# EAGLE design kulgurpower (EAGLE 6.3)

## Sheet 1 of 5
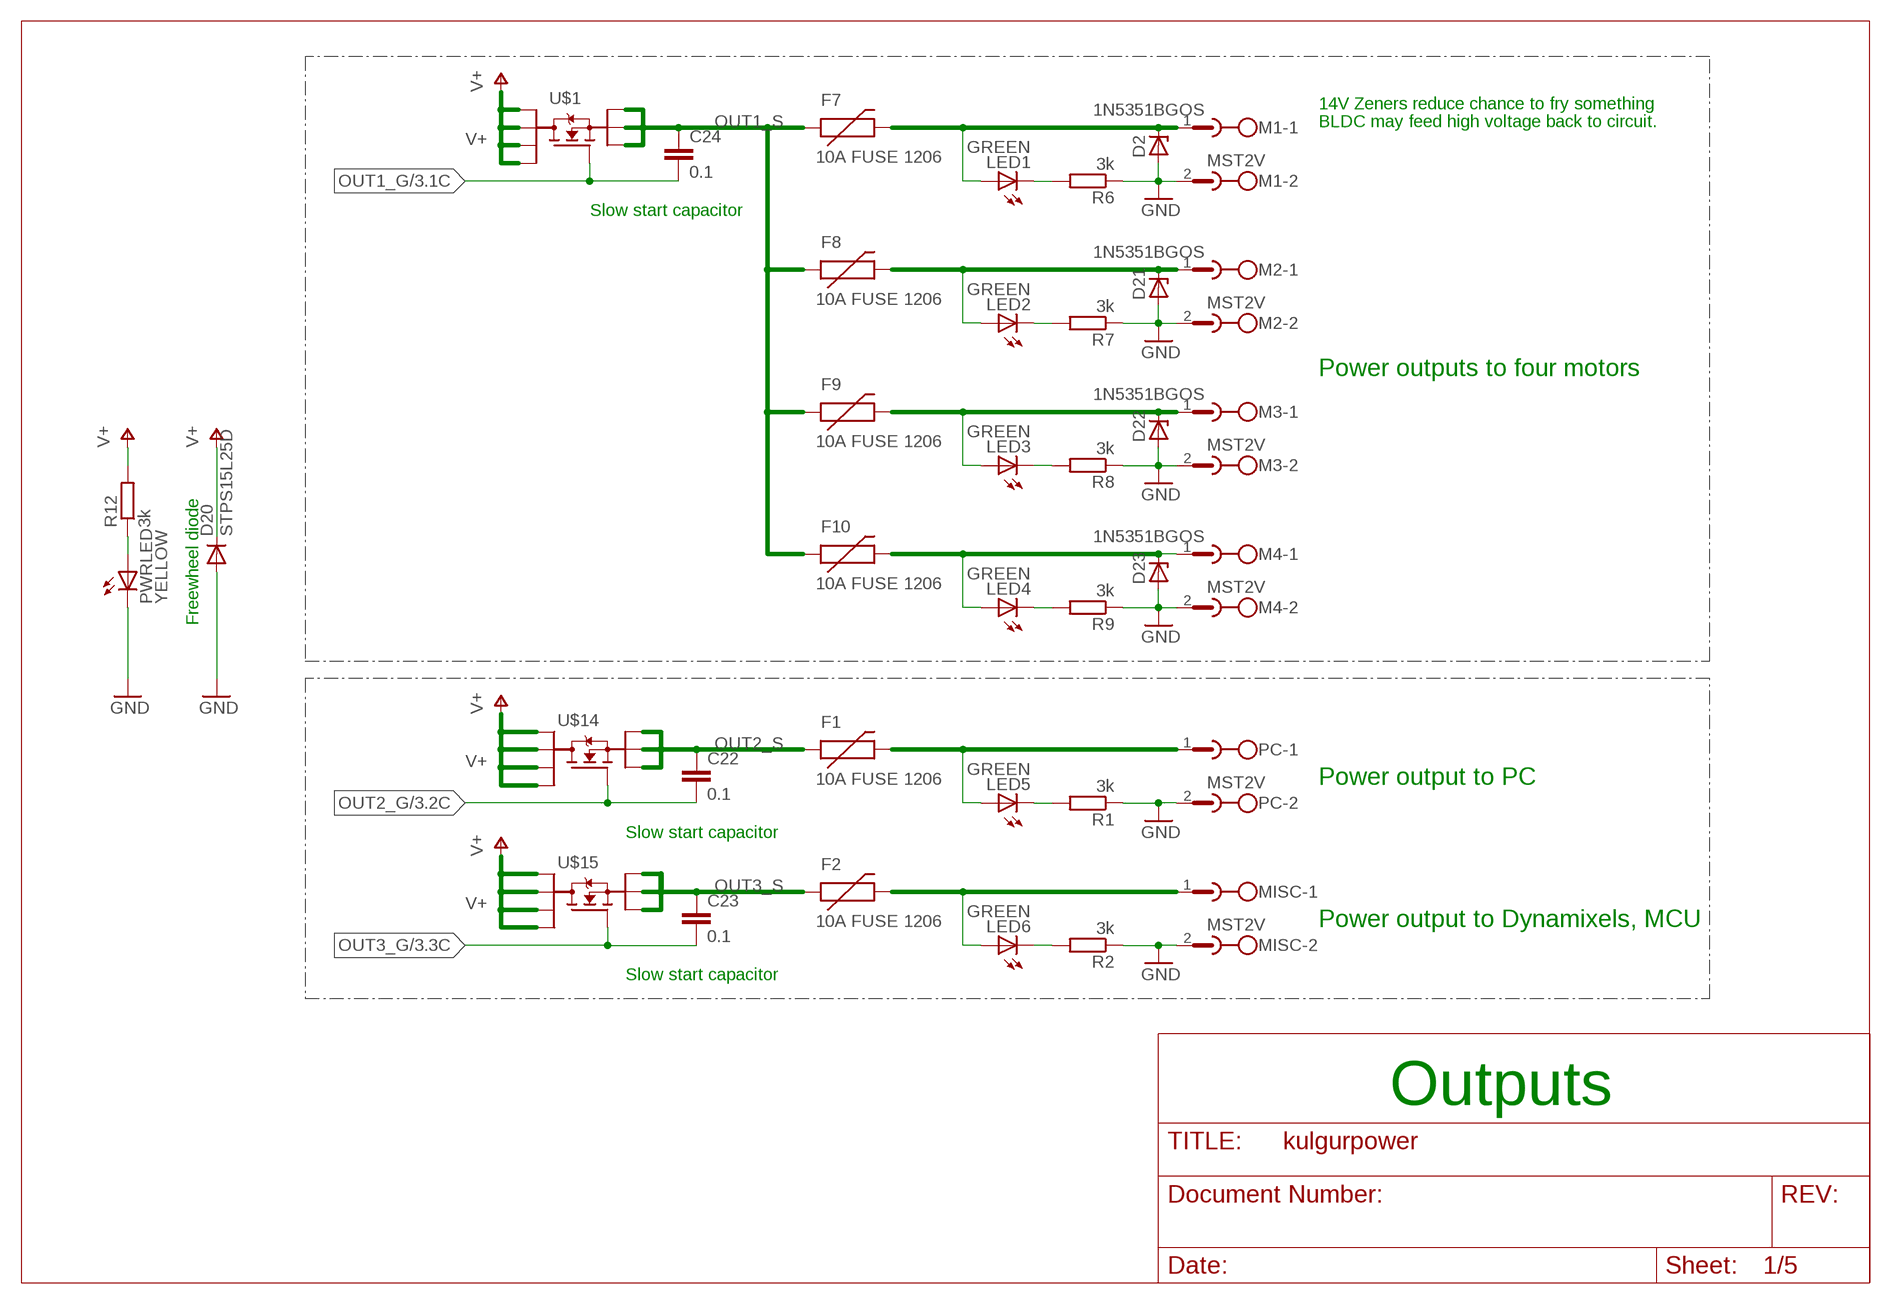
[diagram p0: schematic, sheet 1]

### Parts
C22  0.1  C-EUC0603  [C0603]
C23  0.1  C-EUC0603  [C0603]
C24  0.1  C-EUC0603  [C0603]
D2  1N5351BGOS  1N5333  [C1702-15]
D20  STPS15L25D  DIODE-C221B1A  [C221B1A]
D21  1N5351BGOS  1N5333  [C1702-15]
D22  1N5351BGOS  1N5333  [C1702-15]
D23  1N5351BGOS  1N5333  [C1702-15]
F1  10A FUSE 1206  PTCSMD  [PTC-1206]
F2  10A FUSE 1206  PTCSMD  [PTC-1206]
F7  10A FUSE 1206  PTCSMD  [PTC-1206]
F8  10A FUSE 1206  PTCSMD  [PTC-1206]
F9  10A FUSE 1206  PTCSMD  [PTC-1206]
F10  10A FUSE 1206  PTCSMD  [PTC-1206]
LED1  GREEN  LEDCHIP-LED0603  [CHIP-LED0603]
LED2  GREEN  LEDCHIP-LED0603  [CHIP-LED0603]
LED3  GREEN  LEDCHIP-LED0603  [CHIP-LED0603]
LED4  GREEN  LEDCHIP-LED0603  [CHIP-LED0603]
LED5  GREEN  LEDCHIP-LED0603  [CHIP-LED0603]
LED6  GREEN  LEDCHIP-LED0603  [CHIP-LED0603]
M1  MST2V  [MSTBV2]
M2  MST2V  [MSTBV2]
M3  MST2V  [MSTBV2]
M4  MST2V  [MSTBV2]
MISC  MST2V  [MSTBV2]
PC  MST2V  [MSTBV2]
PWRLED  YELLOW  LEDCHIP-LED0603  [CHIP-LED0603]
R1  3k  R-EU_R0603  [R0603]
R2  3k  R-EU_R0603  [R0603]
R6  3k  R-EU_R0603  [R0603]
R7  3k  R-EU_R0603  [R0603]
R8  3k  R-EU_R0603  [R0603]
R9  3k  R-EU_R0603  [R0603]
R12  3k  R-EU_R0603  [R0603]
U$1  AON6500  FDMS8558S  [POWER56]
U$14  AON6500  FDMS8558S  [POWER56]
U$15  AON6500  FDMS8558S  [POWER56]

### Nets
GND: D2.A D20.A D21.A D22.A D23.A M1.2 M2.2 M3.2 M4.2 MISC.2 PC.2 PWRLED.C R1.1 R2.1 R6.1 R7.1 R8.1 R9.1 ; also sheet 2,3,4,5
N$1 [morepower]: LED1.C R6.2
N$4 [morepower]: LED2.C R7.2
N$7 [morepower]: LED3.C R8.2
N$9 [morepower]: LED4.C R9.2
N$15 [morepower]: LED5.C R1.2
N$17 [morepower]: LED6.C R2.2
N$19 [morepower]: PWRLED.A R12.1
OUT1_G [power]: C24.2 U$1.P$4(G) ; also sheet 3
OUT1_S [morepower]: C24.1 F7.1 F8.1 F9.1 F10.1 U$1.P$1(S1) U$1.P$2(S2) U$1.P$3(S3) ; also sheet 3
OUT2_G [power]: C22.2 U$14.P$4(G) ; also sheet 3
OUT2_S [morepower]: C22.1 F1.1 U$14.P$1(S1) U$14.P$2(S2) U$14.P$3(S3) ; also sheet 3
OUT3_G [power]: C23.2 U$15.P$4(G) ; also sheet 3
OUT3_S [morepower]: C23.1 F2.1 U$15.P$1(S1) U$15.P$2(S2) U$15.P$3(S3) ; also sheet 3
PWR1 [morepower]: D2.C F7.2 LED1.A M1.1
PWR2 [morepower]: D21.C F8.2 LED2.A M2.1
PWR3 [morepower]: D22.C F9.2 LED3.A M3.1
PWR4 [morepower]: D23.C F10.2 LED4.A M4.1
PWR5 [morepower]: F1.2 LED5.A PC.1
PWR6 [morepower]: F2.2 LED6.A MISC.1
V+ [morepower]: D20.C R12.2 U$1.P$5(D4) U$1.P$6(D3) U$1.P$7(D2) U$1.P$8(D1) U$14.P$5(D4) U$14.P$6(D3) U$14.P$7(D2) U$14.P$8(D1) U$15.P$5(D4) U$15.P$6(D3) U$15.P$7(D2) U$15.P$8(D1) ; also sheet 2,3,4,5

### Notes on the sheet
- 14V Zeners reduce chance to fry something
- BLDC may feed high voltage back to circuit.
- Slow start capacitor
- Power outputs to four motors
- Freewheel diode
- Power output to PC
- Slow start capacitor
- Power output to Dynamixels, MCU
- Slow start capacitor
- Outputs

## Sheet 2 of 5
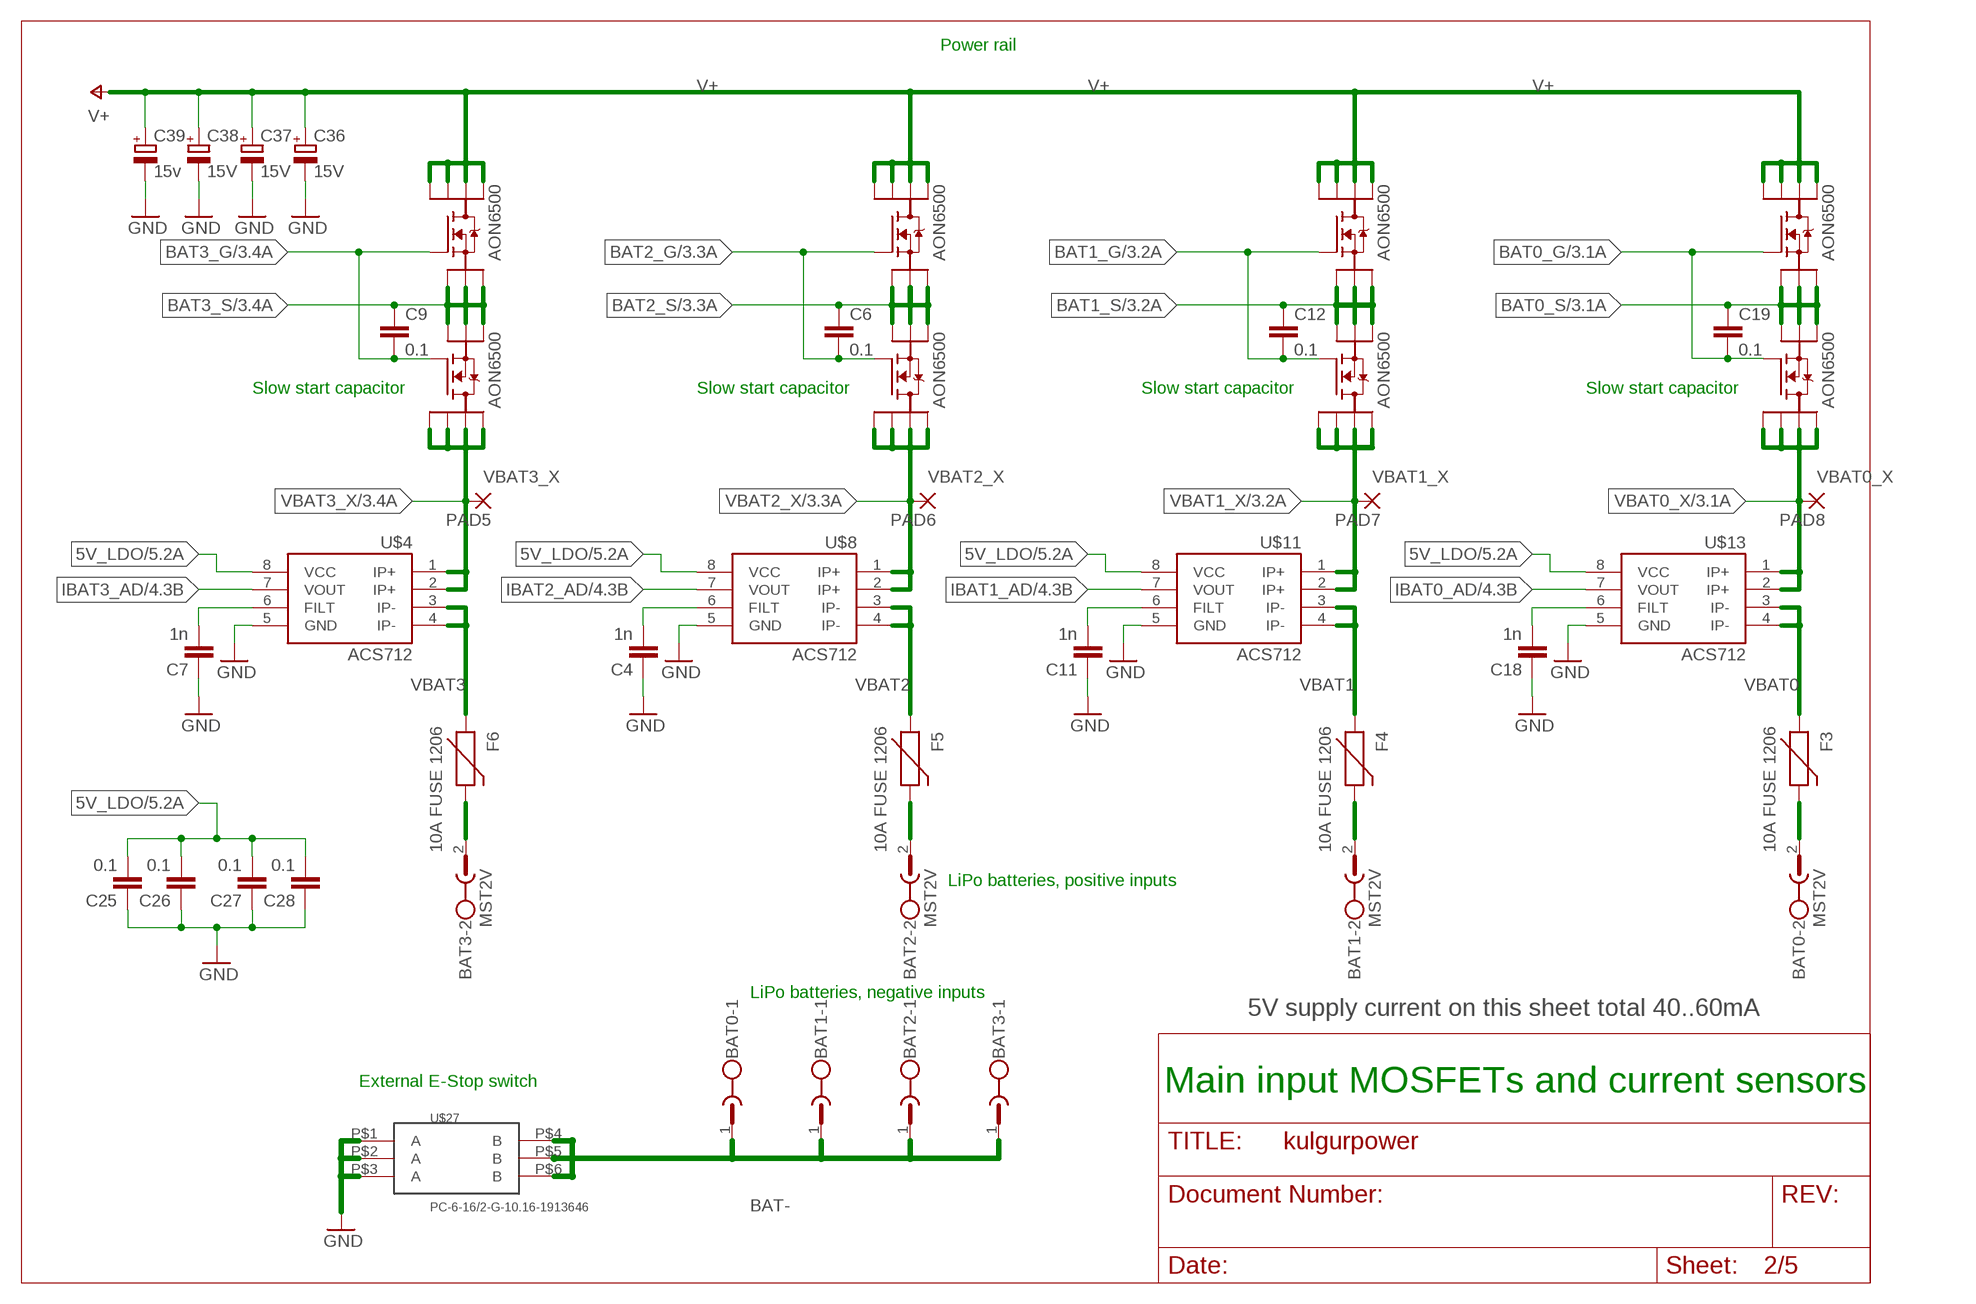
[diagram p1: schematic, sheet 2]

### Parts
BAT0  MST2V  [MSTBV2]
BAT1  MST2V  [MSTBV2]
BAT2  MST2V  [MSTBV2]
BAT3  MST2V  [MSTBV2]
C4  1n  C-EUC0603  [C0603]
C6  0.1  C-EUC0603  [C0603]
C7  1n  C-EUC0603  [C0603]
C9  0.1  C-EUC0603  [C0603]
C11  1n  C-EUC0603  [C0603]
C12  0.1  C-EUC0603  [C0603]
C18  1n  C-EUC0603  [C0603]
C19  0.1  C-EUC0603  [C0603]
C25  0.1  C-EUC0603  [C0603]
C26  0.1  C-EUC0603  [C0603]
C27  0.1  C-EUC0603  [C0603]
C28  0.1  C-EUC0603  [C0603]
C36  15V  CPOL-EUC/6032-28R  [C/6032-28R]
C37  15V  CPOL-EUC/6032-28R  [C/6032-28R]
C38  15V  CPOL-EU175TMP-0810  [175TMP-0810]
C39  15v  CPOL-EU175TMP-0810  [175TMP-0810]
F3  10A FUSE 1206  PTCSMD  [PTC-1206]
F4  10A FUSE 1206  PTCSMD  [PTC-1206]
F5  10A FUSE 1206  PTCSMD  [PTC-1206]
F6  10A FUSE 1206  PTCSMD  [PTC-1206]
PAD5  1,6/0,9  [1,6/0,9]
PAD6  1,6/0,9  [1,6/0,9]
PAD7  1,6/0,9  [1,6/0,9]
PAD8  1,6/0,9  [1,6/0,9]
U$2  AON6500  FDMS8558S  [POWER56]
U$3  AON6500  FDMS8558S  [POWER56]
U$4  ACS712  [SO08]
U$5  AON6500  FDMS8558S  [POWER56]
U$6  AON6500  FDMS8558S  [POWER56]
U$7  AON6500  FDMS8558S  [POWER56]
U$8  ACS712  [SO08]
U$9  AON6500  FDMS8558S  [POWER56]
U$10  AON6500  FDMS8558S  [POWER56]
U$11  ACS712  [SO08]
U$12  AON6500  FDMS8558S  [POWER56]
U$13  ACS712  [SO08]
U$27  PC-6-16/2-G-10.16-1913646  [PC-6-16/2-G-10.16]

### Nets
5V_LDO [power]: C25.2 C26.2 C27.2 C28.2 U$4.8(VCC) U$8.8(VCC) U$11.8(VCC) U$13.8(VCC) ; also sheet 5
BAT0_G [power]: C19.2 U$5.P$4(G) U$12.P$4(G) ; also sheet 3
BAT0_S [power]: C19.1 U$5.P$1(S1) U$5.P$2(S2) U$5.P$3(S3) U$12.P$1(S1) U$12.P$2(S2) U$12.P$3(S3) ; also sheet 3
BAT1_G [power]: C12.2 U$9.P$4(G) U$10.P$4(G) ; also sheet 3
BAT1_S [power]: C12.1 U$9.P$1(S1) U$9.P$2(S2) U$9.P$3(S3) U$10.P$1(S1) U$10.P$2(S2) U$10.P$3(S3) ; also sheet 3
BAT2_G [power]: C6.2 U$6.P$4(G) U$7.P$4(G) ; also sheet 3
BAT2_S [power]: C6.1 U$6.P$1(S1) U$6.P$2(S2) U$6.P$3(S3) U$7.P$1(S1) U$7.P$2(S2) U$7.P$3(S3) ; also sheet 3
BAT3_G [power]: C9.2 U$2.P$4(G) U$3.P$4(G) ; also sheet 3
BAT3_S [power]: C9.1 U$2.P$1(S1) U$2.P$2(S2) U$2.P$3(S3) U$3.P$1(S1) U$3.P$2(S2) U$3.P$3(S3) ; also sheet 3
BAT- [morepower]: BAT0.1 BAT1.1 BAT2.1 BAT3.1 U$27.P$4(B) U$27.P$5(B) U$27.P$6(B)
GND: C4.1 C7.1 C11.1 C18.1 C25.1 C26.1 C27.1 C28.1 C36.- C37.- C38.- C39.- U$4.5(GND) U$8.5(GND) U$11.5(GND) U$13.5(GND) U$27.P$1(A) U$27.P$2(A) U$27.P$3(A) ; also sheet 1,3,4,5
IBAT0_AD [power]: U$13.7(VOUT) ; also sheet 4
IBAT1_AD [power]: U$11.7(VOUT) ; also sheet 4
IBAT2_AD [power]: U$8.7(VOUT) ; also sheet 4
IBAT3_AD [power]: U$4.7(VOUT) ; also sheet 4
N$8 [morepower]: BAT0.2 F3.2
N$10 [morepower]: BAT1.2 F4.2
N$11 [power]: C4.2 U$8.6(FILT)
N$12 [morepower]: BAT2.2 F5.2
N$13 [morepower]: BAT3.2 F6.2
N$14 [power]: C11.2 U$11.6(FILT)
N$21 [power]: C7.2 U$4.6(FILT)
N$27 [power]: C18.2 U$13.6(FILT)
V+ [morepower]: C36.+ C37.+ C38.+ C39.+ U$2.P$5(D4) U$2.P$6(D3) U$2.P$7(D2) U$2.P$8(D1) U$5.P$5(D4) U$5.P$6(D3) U$5.P$7(D2) U$5.P$8(D1) U$6.P$5(D4) U$6.P$6(D3) U$6.P$7(D2) U$6.P$8(D1) U$9.P$5(D4) U$9.P$6(D3) U$9.P$7(D2) U$9.P$8(D1) ; also sheet 1,3,4,5
VBAT0 [morepower]: F3.1 U$13.3(IP-) U$13.4(IP-)
VBAT0_X [morepower]: PAD8.1(P) U$12.P$5(D4) U$12.P$6(D3) U$12.P$7(D2) U$12.P$8(D1) U$13.1(IP+) U$13.2(IP+) ; also sheet 3,4
VBAT1 [morepower]: F4.1 U$11.3(IP-) U$11.4(IP-)
VBAT1_X [morepower]: PAD7.1(P) U$10.P$5(D4) U$10.P$6(D3) U$10.P$7(D2) U$10.P$8(D1) U$11.1(IP+) U$11.2(IP+) ; also sheet 3,4
VBAT2 [morepower]: F5.1 U$8.3(IP-) U$8.4(IP-)
VBAT2_X [morepower]: PAD6.1(P) U$7.P$5(D4) U$7.P$6(D3) U$7.P$7(D2) U$7.P$8(D1) U$8.1(IP+) U$8.2(IP+) ; also sheet 3,4
VBAT3 [morepower]: F6.1 U$4.3(IP-) U$4.4(IP-)
VBAT3_X [morepower]: PAD5.1(P) U$3.P$5(D4) U$3.P$6(D3) U$3.P$7(D2) U$3.P$8(D1) U$4.1(IP+) U$4.2(IP+) ; also sheet 3,4

### Notes on the sheet
- Power rail
- Slow start capacitor | Slow start capacitor | Slow start capacitor | Slow start capacitor
- LiPo batteries, positive inputs
- LiPo batteries, negative inputs
- 5V supply current on this sheet total 40..60mA
- External E-Stop switch
- Main input MOSFETs and current sensors

## Sheet 3 of 5
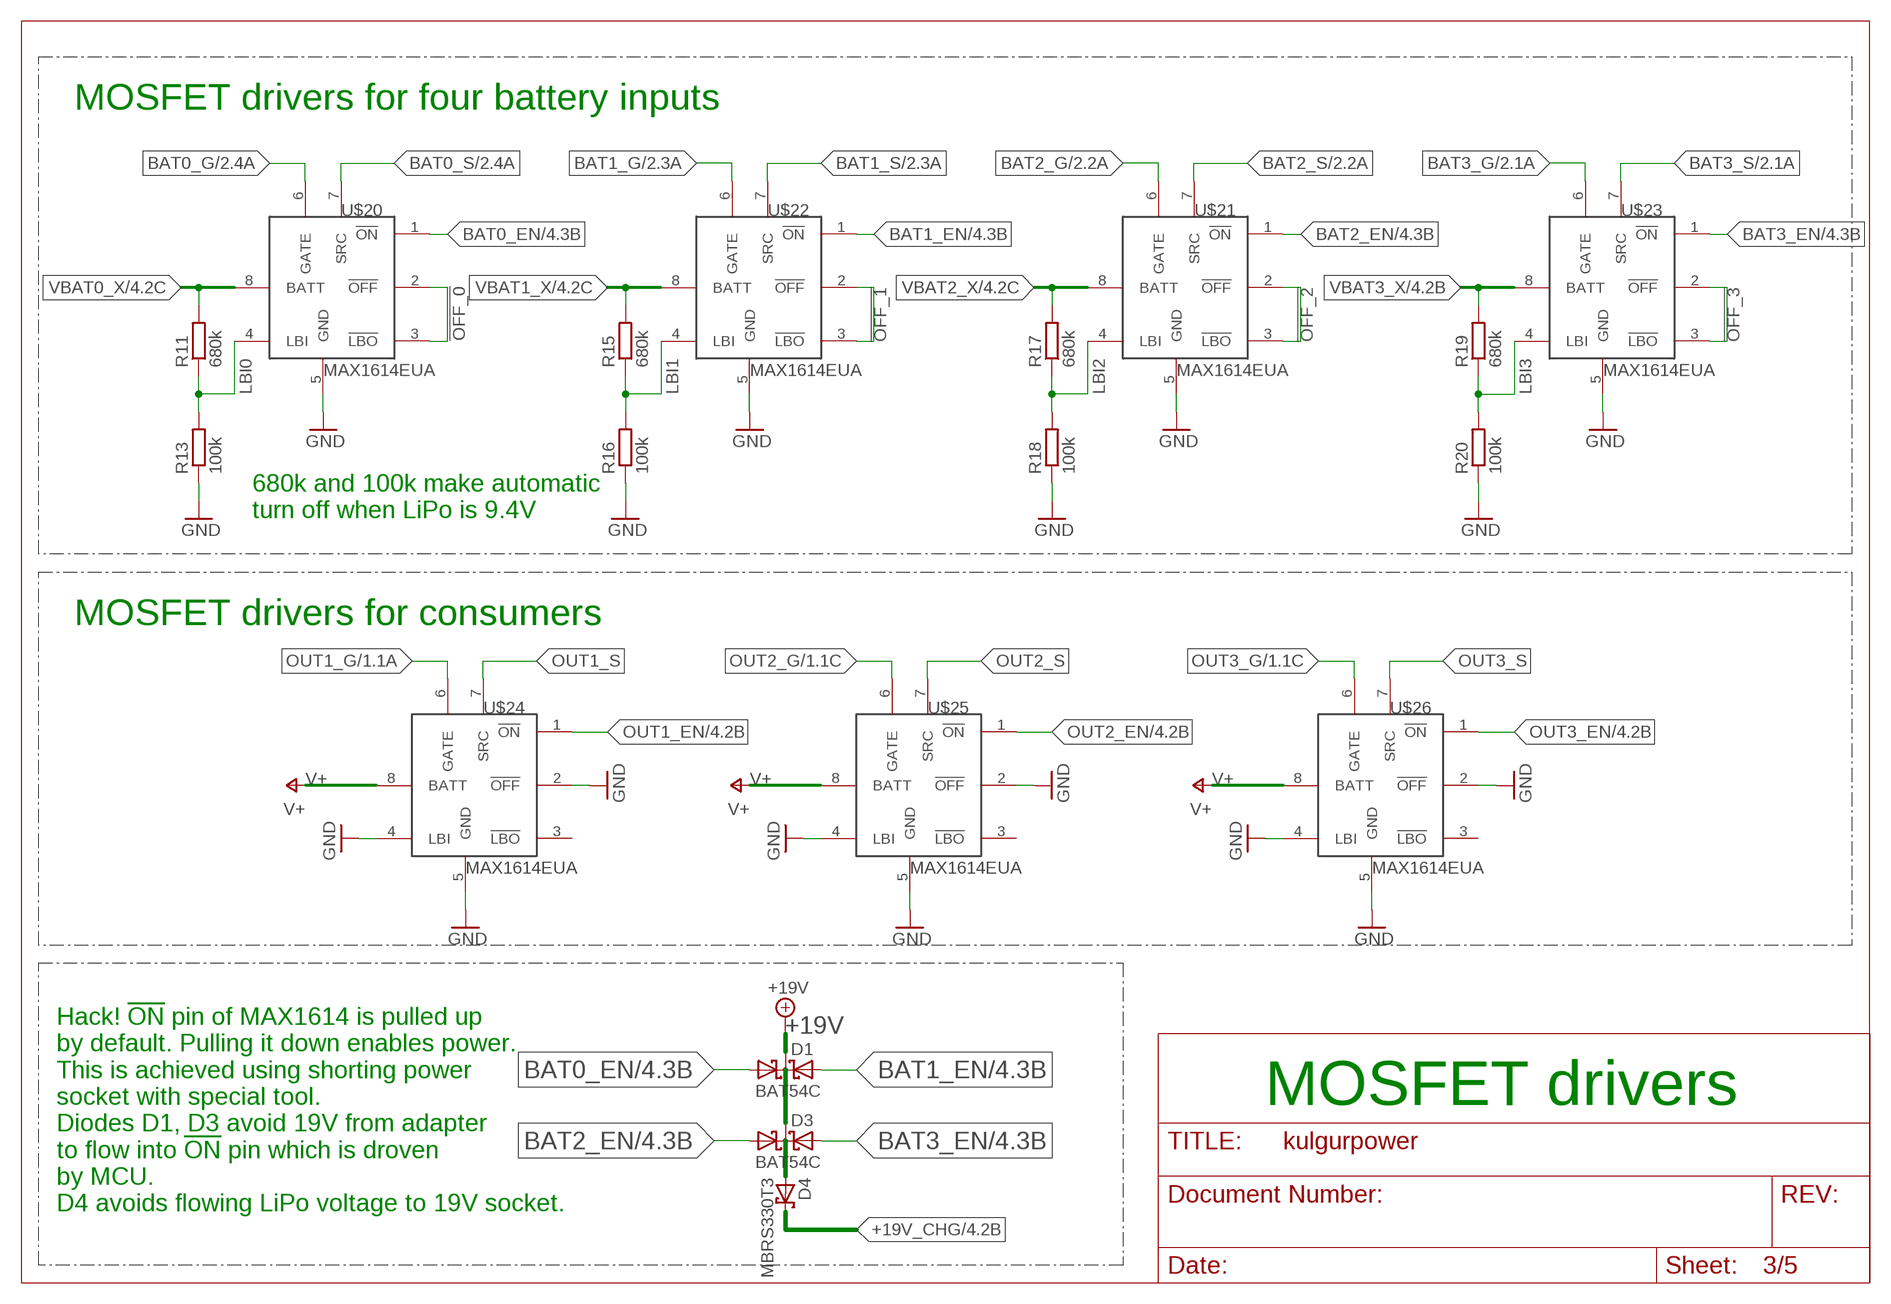
[diagram p2: schematic, sheet 3]

### Parts
D1  BAT54C  [SOT23]
D3  BAT54C  [SOT23]
D4  MBRS330T3  [SMC]
R11  680k  R-EU_R0603  [R0603]
R13  100k  R-EU_R0603  [R0603]
R15  680k  R-EU_R0603  [R0603]
R16  100k  R-EU_R0603  [R0603]
R17  680k  R-EU_R0603  [R0603]
R18  100k  R-EU_R0603  [R0603]
R19  680k  R-EU_R0603  [R0603]
R20  100k  R-EU_R0603  [R0603]
U$20  MAX1614EUA  [MAX1614EUA]
U$21  MAX1614EUA  [MAX1614EUA]
U$22  MAX1614EUA  [MAX1614EUA]
U$23  MAX1614EUA  [MAX1614EUA]
U$24  MAX1614EUA  [MAX1614EUA]
U$25  MAX1614EUA  [MAX1614EUA]
U$26  MAX1614EUA  [MAX1614EUA]

### Nets
!OFF_0 [morepower]: U$20.2(!OFF) U$20.3(!LBO)
!OFF_1 [morepower]: U$22.2(!OFF) U$22.3(!LBO)
!OFF_2 [morepower]: U$21.2(!OFF) U$21.3(!LBO)
!OFF_3 [morepower]: U$23.2(!OFF) U$23.3(!LBO)
+19V [morepower]: D1.3(CC) D3.3(CC) ; also sheet 4
+19V_CHG: D4.C ; also sheet 4
BAT0_EN [power]: D1.1(A1) U$20.1(!ON) ; also sheet 4
BAT0_G [power]: U$20.6(GATE) ; also sheet 2
BAT0_S [power]: U$20.7(SRC) ; also sheet 2
BAT1_EN [power]: D1.2(A2) U$22.1(!ON) ; also sheet 4
BAT1_G [power]: U$22.6(GATE) ; also sheet 2
BAT1_S [power]: U$22.7(SRC) ; also sheet 2
BAT2_EN [power]: D3.1(A1) U$21.1(!ON) ; also sheet 4
BAT2_G [power]: U$21.6(GATE) ; also sheet 2
BAT2_S [power]: U$21.7(SRC) ; also sheet 2
BAT3_EN [power]: D3.2(A2) U$23.1(!ON) ; also sheet 4
BAT3_G [power]: U$23.6(GATE) ; also sheet 2
BAT3_S [power]: U$23.7(SRC) ; also sheet 2
GND: R13.1 R16.1 R18.1 R20.1 U$20.5(GND) U$21.5(GND) U$22.5(GND) U$23.5(GND) U$24.2(!OFF) U$24.4(LBI) U$24.5(GND) U$25.2(!OFF) U$25.4(LBI) U$25.5(GND) U$26.2(!OFF) U$26.4(LBI) U$26.5(GND) ; also sheet 1,2,4,5
LBI0 [morepower]: R11.1 R13.2 U$20.4(LBI)
LBI1 [morepower]: R15.1 R16.2 U$22.4(LBI)
LBI2 [morepower]: R17.1 R18.2 U$21.4(LBI)
LBI3 [morepower]: R19.1 R20.2 U$23.4(LBI)
N$2: D4.A
OUT1_EN [power]: U$24.1(!ON) ; also sheet 4
OUT1_G [power]: U$24.6(GATE) ; also sheet 1
OUT1_S [morepower]: U$24.7(SRC) ; also sheet 1
OUT2_EN [power]: U$25.1(!ON) ; also sheet 4
OUT2_G [power]: U$25.6(GATE) ; also sheet 1
OUT2_S [morepower]: U$25.7(SRC) ; also sheet 1
OUT3_EN [power]: U$26.1(!ON) ; also sheet 4
OUT3_G [power]: U$26.6(GATE) ; also sheet 1
OUT3_S [morepower]: U$26.7(SRC) ; also sheet 1
V+ [morepower]: U$24.8(BATT) U$25.8(BATT) U$26.8(BATT) ; also sheet 1,2,4,5
VBAT0_X [morepower]: R11.2 U$20.8(BATT) ; also sheet 2,4
VBAT1_X [morepower]: R15.2 U$22.8(BATT) ; also sheet 2,4
VBAT2_X [morepower]: R17.2 U$21.8(BATT) ; also sheet 2,4
VBAT3_X [morepower]: R19.2 U$23.8(BATT) ; also sheet 2,4
Unconnected: U$24.3(!LBO) U$25.3(!LBO) U$26.3(!LBO)

### Notes on the sheet
- MOSFET drivers for four battery inputs
- 680k and 100k make automatic 
  turn off when LiPo is 9.4V
- MOSFET drivers for consumers
- MOSFET drivers
- Hack! !ON! pin of MAX1614 is pulled up 
  by default. Pulling it down enables power. 
  This is achieved using shorting power
  socket with special tool.
  Diodes D1, D3 avoid 19V from adapter 
  to flow into !ON! pin which is droven 
  by MCU.
  D4 avoids flowing LiPo voltage to 19V socket.

## Sheet 4 of 5
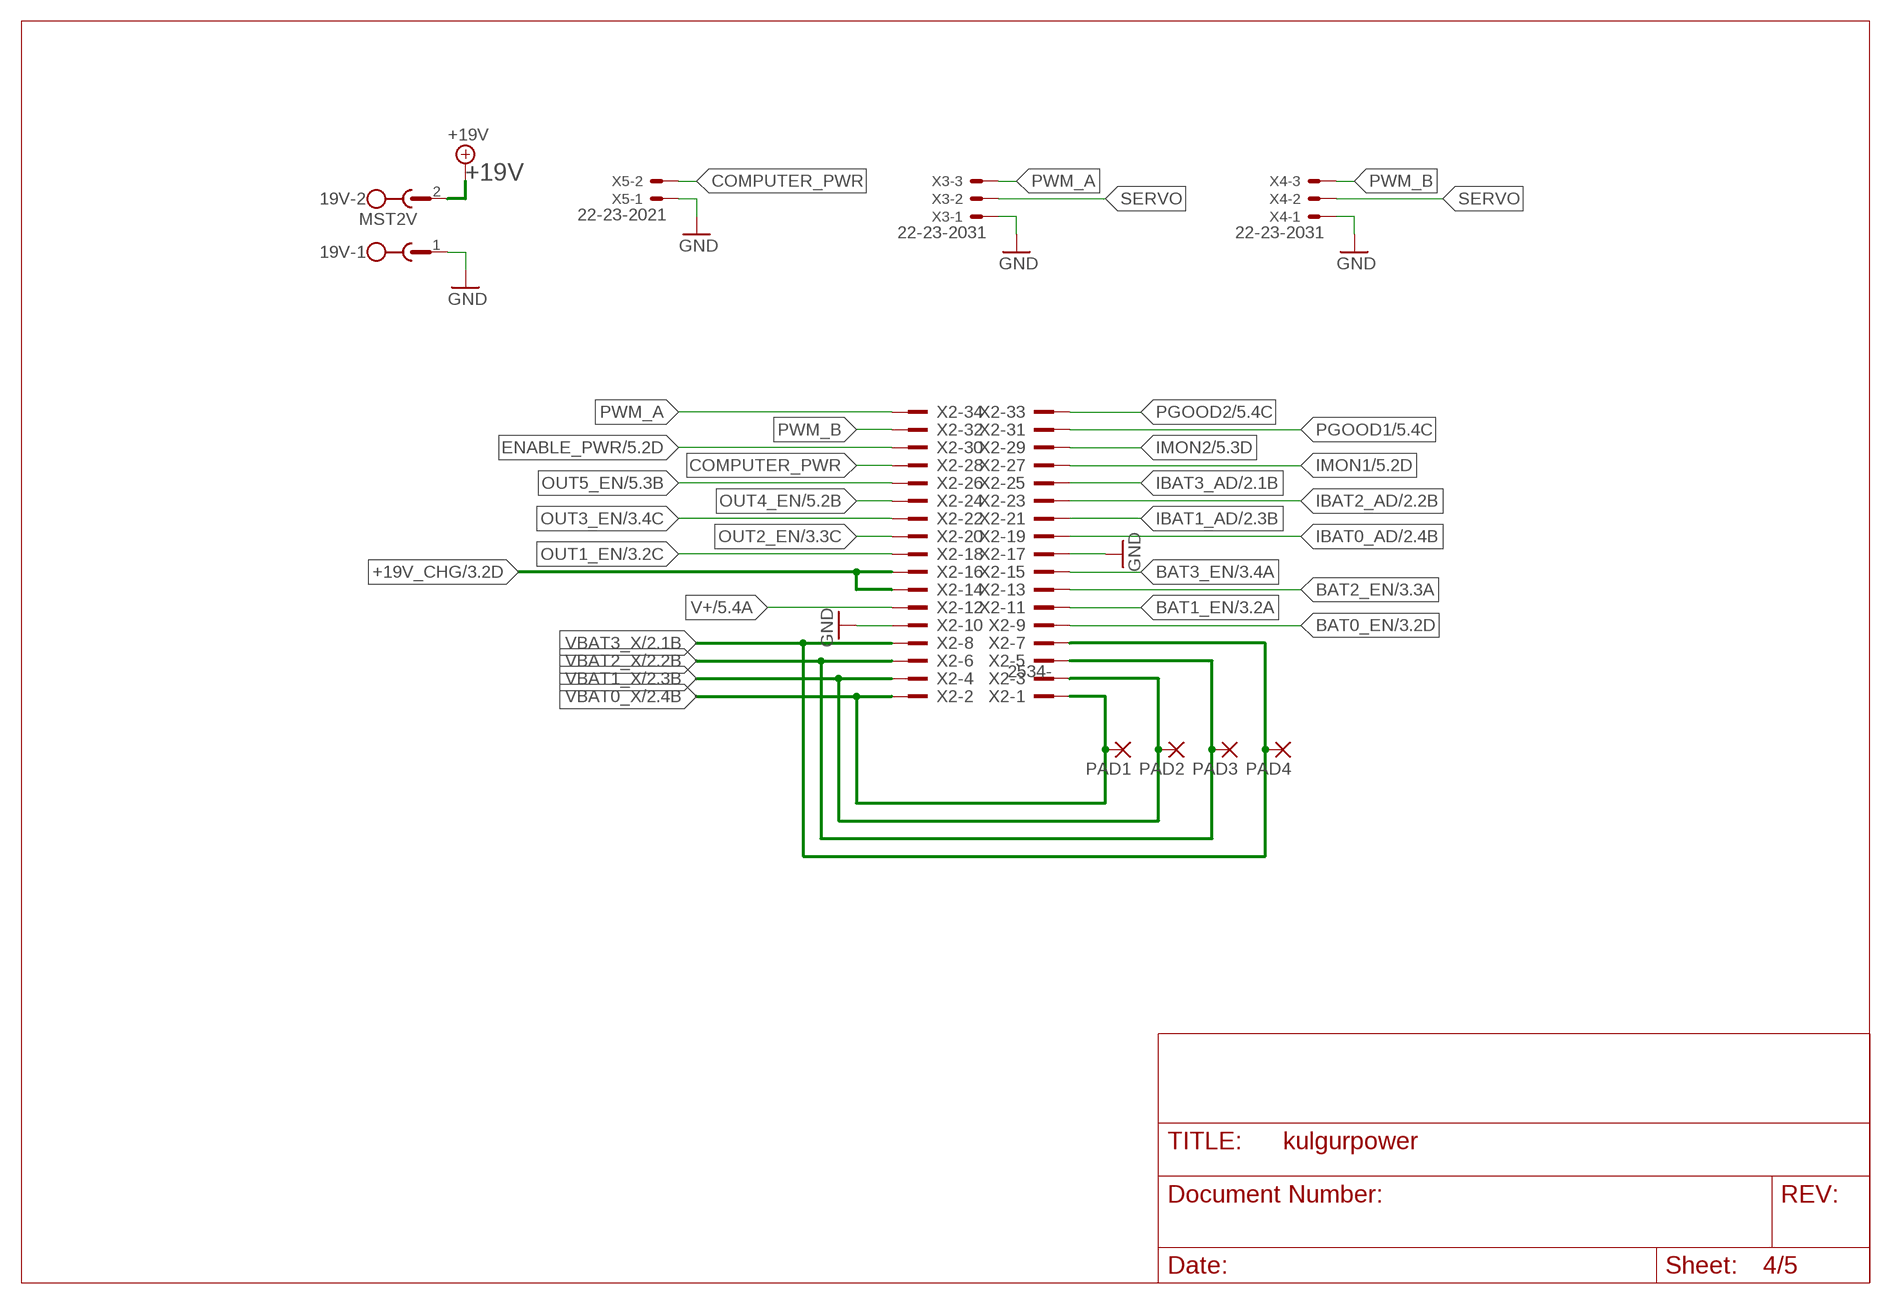
[diagram p3: schematic, sheet 4]

### Parts
19V  MST2V  [MSTBV2]
PAD1  1,6/0,9  [1,6/0,9]
PAD2  1,6/0,9  [1,6/0,9]
PAD3  1,6/0,9  [1,6/0,9]
PAD4  1,6/0,9  [1,6/0,9]
X2  2534-  [PAK100/2500-34]
X3  22-23-2031  [22-23-2031]
X4  22-23-2031  [22-23-2031]
X5  22-23-2021  [22-23-2021]

### Nets
+19V [morepower]: 19V.2 ; also sheet 3
+19V_CHG: X2.14 X2.16 ; also sheet 3
BAT0_EN [power]: X2.9 ; also sheet 3
BAT1_EN [power]: X2.11 ; also sheet 3
BAT2_EN [power]: X2.13 ; also sheet 3
BAT3_EN [power]: X2.15 ; also sheet 3
COMPUTER_PWR [power]: X2.28 X5.2
ENABLE_PWR: X2.30 ; also sheet 5
GND: 19V.1 X2.10 X2.17 X3.1 X4.1 X5.1 ; also sheet 1,2,3,5
IBAT0_AD [power]: X2.19 ; also sheet 2
IBAT1_AD [power]: X2.21 ; also sheet 2
IBAT2_AD [power]: X2.23 ; also sheet 2
IBAT3_AD [power]: X2.25 ; also sheet 2
IMON1: X2.27 ; also sheet 5
IMON2: X2.29 ; also sheet 5
OUT1_EN [power]: X2.18 ; also sheet 3
OUT2_EN [power]: X2.20 ; also sheet 3
OUT3_EN [power]: X2.22 ; also sheet 3
OUT4_EN: X2.24 ; also sheet 5
OUT5_EN: X2.26 ; also sheet 5
PGOOD1: X2.31 ; also sheet 5
PGOOD2: X2.33 ; also sheet 5
PWM_A [power]: X2.34 X3.3
PWM_B [power]: X2.32 X4.3
SERVO [morepower]: X3.2 X4.2 ; also sheet 5
V+ [morepower]: X2.12 ; also sheet 1,2,3,5
VBAT0_X [morepower]: PAD1.1(P) X2.1 X2.2 ; also sheet 2,3
VBAT1_X [morepower]: PAD2.1(P) X2.3 X2.4 ; also sheet 2,3
VBAT2_X [morepower]: PAD3.1(P) X2.5 X2.6 ; also sheet 2,3
VBAT3_X [morepower]: PAD4.1(P) X2.7 X2.8 ; also sheet 2,3

## Sheet 5 of 5
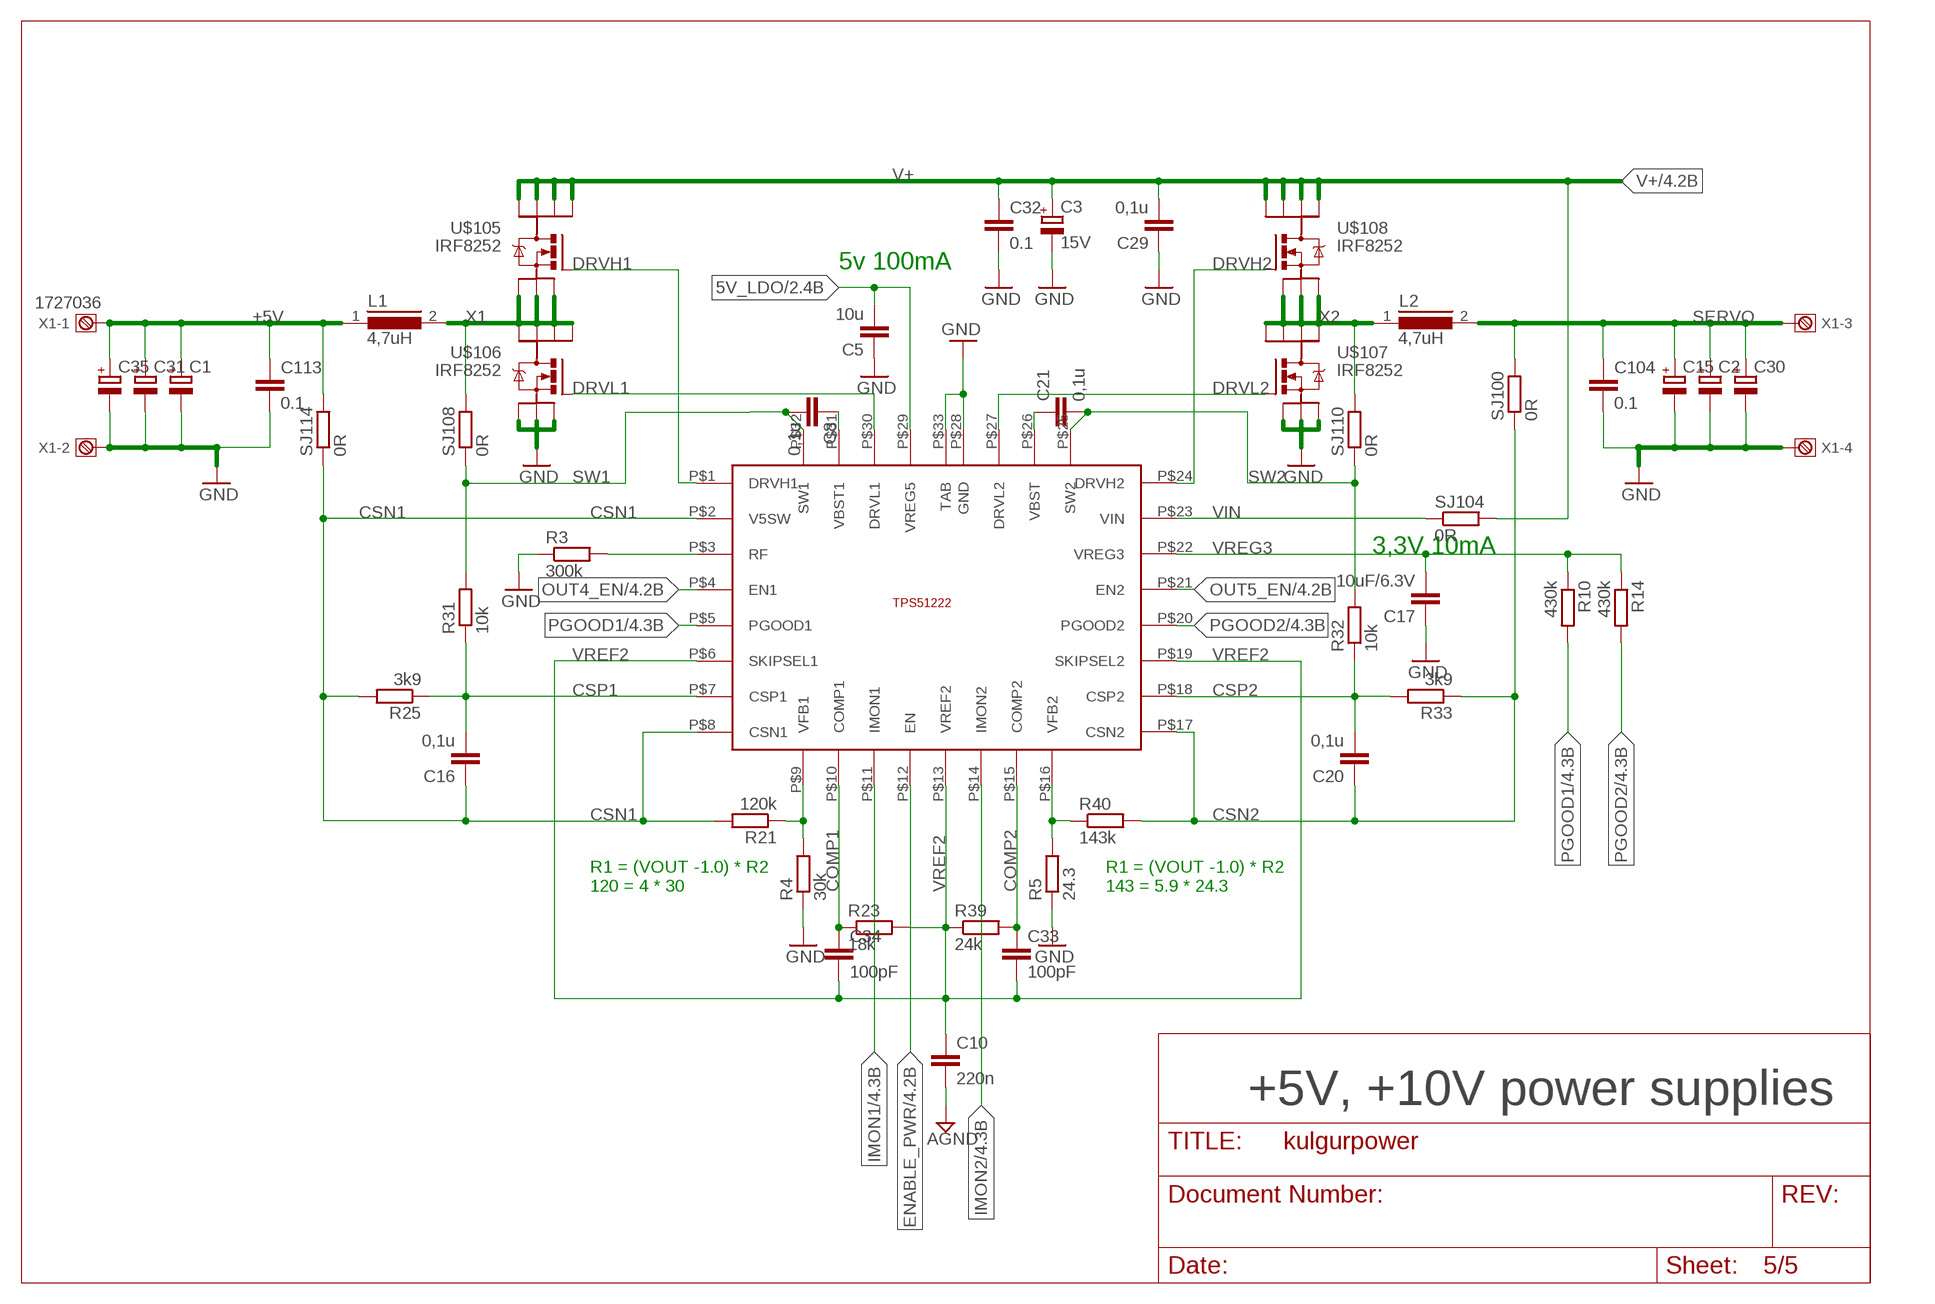
[diagram p4: schematic, sheet 5]

### Parts
C1  CPOL-EUC/6032-28R  [C/6032-28R]
C2  CPOL-EUC/6032-28R  [C/6032-28R]
C3  15V  CPOL-EUC/6032-28R  [C/6032-28R]
C5  10u  C-EUC1210  [C1210]
C8  0,1u  C-EUC0603  [C0603]
C10  220n  C-EUC0603  [C0603]
C15  CPOL-EUC/6032-28R  [C/6032-28R]
C16  0,1u  C-EUC0603  [C0603]
C17  10uF/6.3V  C-EUC1210  [C1210]
C20  0,1u  C-EUC0603  [C0603]
C21  0,1u  C-EUC0603  [C0603]
C29  0,1u  C-EUC0603  [C0603]
C30  CPOL-EUC/6032-28R  [C/6032-28R]
C31  CPOL-EUC/6032-28R  [C/6032-28R]
C32  0.1  C-EUC0603  [C0603]
C33  100pF  CAP0805  [0805]
C34  100pF  CAP0805  [0805]
C35  CPOL-EUC/6032-28R  [C/6032-28R]
C104  0.1  C-EUC0603  [C0603]
C113  0.1  C-EUC0603  [C0603]
L1  4,7uH  DR125  [DR125]
L2  4,7uH  DR125  [DR125]
R3  300k  R-EU_R0603  [R0603]
R4  30k  R-EU_R0603  [R0603]
R5  24.3  R-EU_R0603  [R0603]
R10  430k  R-EU_R0603  [R0603]
R14  430k  R-EU_R0603  [R0603]
R21  120k  R-EU_R0603  [R0603]
R23  18k  R-EU_R0603  [R0603]
R25  3k9  R-EU_R0603  [R0603]
R31  10k  R-EU_R0603  [R0603]
R32  10k  R-EU_R0603  [R0603]
R33  3k9  R-EU_R0603  [R0603]
R39  24k  R-EU_R0603  [R0603]
R40  143k  R-EU_R0603  [R0603]
SJ100  0R  R-EU_R0603  [R0603]
SJ104  0R  R-EU_R0603  [R0603]
SJ108  0R  R-EU_R0603  [R0603]
SJ110  0R  R-EU_R0603  [R0603]
SJ114  0R  R-EU_R0603  [R0603]
U$17  TPS51222RTVT  [QFN-32]
U$105  IRF8252  [SO8]
U$106  IRF8252  [SO8]
U$107  IRF8252  [SO8]
U$108  IRF8252  [SO8]
X1  1727036  [1727036]

### Nets
5V_LDO [power]: C5.2 U$17.P$29(VREG5) ; also sheet 2
+5V [morepower]: C1.+ C31.+ C35.+ C113.1 L1.1 SJ114.2 X1.1
COMP1: C34.1 R23.1 U$17.P$10(COMP1)
COMP2: C33.1 R39.2 U$17.P$15(COMP2)
CSN1: C16.1 R21.2 R25.2 SJ114.1 U$17.P$2(V5SW) U$17.P$8(CSN1)
CSN2: C20.1 R33.1 R40.2 SJ100.1 U$17.P$17(CSN2)
CSP1: C16.2 R25.1 R31.1 U$17.P$7(CSP1)
CSP2: C20.2 R32.1 R33.2 U$17.P$18(CSP2)
DRVH1: U$17.P$1(DRVH1) U$105.4(G)
DRVH2: U$17.P$24(DRVH2) U$108.4(G)
DRVL1: U$17.P$30(DRVL1) U$106.4(G)
DRVL2: U$17.P$27(DRVL2) U$107.4(G)
ENABLE_PWR: U$17.P$12(EN) ; also sheet 4
GND: C1.- C2.- C3.- C5.1 C10.2 C15.- C17.1 C29.1 C30.- C31.- C32.2 C35.- C104.2 C113.2 R3.1 R4.1 R5.1 U$17.P$28(GND) U$17.P$33(TAB) U$106.1(S) U$106.2(S) U$106.3(S) U$107.1(S) U$107.2(S) U$107.3(S) X1.2 X1.4 ; supply symbol labelled AGND ; also sheet 1,2,3,4
IMON1: U$17.P$11(IMON1) ; also sheet 4
IMON2: U$17.P$14(IMON2) ; also sheet 4
N$5: R4.2 R21.1 U$17.P$9(VFB1)
N$18: R5.2 R40.1 U$17.P$16(VFB2)
N$24: R3.2 U$17.P$3(RF)
N$29: C8.1 U$17.P$31(VBST1)
N$30: C21.1 U$17.P$26(VBST)
OUT4_EN: U$17.P$4(EN1) ; also sheet 4
OUT5_EN: U$17.P$21(EN2) ; also sheet 4
PGOOD1: R10.2 U$17.P$5(PGOOD1) ; also sheet 4
PGOOD2: R14.2 U$17.P$20(PGOOD2) ; also sheet 4
SERVO [morepower]: C2.+ C15.+ C30.+ C104.1 L2.2 SJ100.2 X1.3 ; also sheet 4
SW1: C8.2 R31.2 SJ108.1 U$17.P$32(SW1)
SW2: C21.2 R32.2 SJ110.1 U$17.P$25(SW2)
V+ [morepower]: C3.+ C29.2 C32.1 SJ104.2 U$105.5(D) U$105.6(D) U$105.7(D) U$105.8(D) U$108.5(D) U$108.6(D) U$108.7(D) U$108.8(D) ; also sheet 1,2,3,4
VIN: SJ104.1 U$17.P$23(VIN)
VREF2: C10.1 C33.2 C34.2 R23.2 R39.1 U$17.P$6(SKIPSEL1) U$17.P$13(VREF2) U$17.P$19(SKIPSEL2)
VREG3: C17.2 R10.1 R14.1 U$17.P$22(VREG3)
X1 [morepower]: L1.2 SJ108.2 U$105.1(S) U$105.2(S) U$105.3(S) U$106.5(D) U$106.6(D) U$106.7(D) U$106.8(D)
X2 [morepower]: L2.1 SJ110.2 U$107.5(D) U$107.6(D) U$107.7(D) U$107.8(D) U$108.1(S) U$108.2(S) U$108.3(S)

### Notes on the sheet
- 5v 100mA
- 3,3V 10mA
- R1 = (VOUT -1.0) * R2
  120 = 4 * 30
- R1 = (VOUT -1.0) * R2
  143 = 5.9 * 24.3
- +5V, +10V power supplies

## Library data of the parts
19V BAT0 BAT1-BAT3 M1-M4 MISC PC = con-phoenix-508:MST2V: PHOENIX
C1-C3 C15 C30 C31 C35-C39 = rcl:CPOL-EU: POLARIZED CAPACITOR, European symbol
C4-C12 C16-C29 C32 C104 C113 = rcl:C-EU: CAPACITOR, European symbol
C33 C34 = SparkFun:CAP: Capacitor Standard 0603 ceramic capacitor, and 0.1" leaded capacitor.
D1 D3 = diode:BAT54C: Schottky Diodes Source: Fairchild .. BAT54.pdf
D2 D21-D23 = diode:1N5333: Z DIODE 3.3 V, 5W, 5 percent (Motorola)
D4 = diode:MBRS3*0T3: SCHOTTKY BARRIER RECTIFIER 3.0 AMPERES 20, 30, 40 VOLT Source: MBRS340T3-D.pdf
D20 = diode:DIODE-: DIODE
F1-F10 = SparkFun-PowerIC:PTC: Resettable Fuse PTC Resettable Fuse. Spark Fun Electronics SKU : COM-08357
L1 L2 = inductors:DR125: High Power Density, High Efficiency, Shielded Inductors Source: coiltronics_dr_series.pdf
LED1-LED6 PWRLED = led:LED: LED OSRAM: - CHIPLED LG R971, LG N971, LY N971, LG Q971, LY Q971, LO R971, LY R971 LH N974, LH R974 LS Q976, LO Q976, LY Q976 LO Q996 - Hyper CHIPLED LW Q18S LB Q993, LB Q99A, LB R99A - SideLED LS A670, LO A670, LY A670, LG A670, LP A670 LB A673, LV A673, LT A673, LW A673 LH A674 LY A675 LS A676, LA A676, LO A676, LY A676, LW A676 LS A679, LY A679, LG A679 - Hyper Micro SIDELED® LS Y876, LA Y876, LO Y876, LY Y876 LT Y87S - SmartLED LW L88C, LW L88S LB L89C, LB L89S, LG L890 LS L89K, LO L89K, LY L89K LS L896, LA L896, LO L896, LY L896 - TOPLED LS T670, LO T670, LY T670, LG T670, LP T670 LSG T670, LSP T670, LSY T670, LOP T670, LYG T670 LG T671, LOG T671, LSG T671 LB T673, LV T673, LT T673, LW T673 LH T674 LS T676, LA T676, LO T676, LY T676, LB T676, LH T676, LSB T676, LW T676 LB T67C, LV T67C, LT T67C, LS T67K, LO T67K, LY T67K, LW E67C LS E67B, LA E67B, LO E67B, LY E67B, LB E67C, LV E67C, LT E67C LW T67C LS T679, LY T679, LG T679 LS T770, LO T770, LY T770, LG T770, LP T770 LB T773, LV T773, LT T773, LW T773 LH T774 LS E675, LA E675, LY E675, LS T675 LS T776, LA T776, LO T776, LY T776, LB T776 LHGB T686 LT T68C, LB T68C - Hyper Mini TOPLED® LB M676 - Mini TOPLED Santana® LG M470 LS M47K, LO M47K, LY M47K Source: http://www.osram.convergy.de LUXEON: - LUMILED® LXK2-PW12-R00, LXK2-PW12-S00, LXK2-PW14-U00, LXK2-PW14-V00 LXK2-PM12-R00, LXK2-PM12-S00, LXK2-PM14-U00 LXK2-PE12-Q00, LXK2-PE12-R00, LXK2-PE12-S00, LXK2-PE14-T00, LXK2-PE14-U00 LXK2-PB12-K00, LXK2-PB12-L00, LXK2-PB12-M00, LXK2-PB14-N00, LXK2-PB14-P00, LXK2-PB14-Q00 LXK2-PR12-L00, LXK2-PR12-M00, LXK2-PR14-Q00, LXK2-PR14-R00 LXK2-PD12-Q00, LXK2-PD12-R00, LXK2-PD12-S00 LXK2-PH12-R00, LXK2-PH12-S00 LXK2-PL12-P00, LXK2-PL12-Q00, LXK2-PL12-R00 Source: www.luxeon.com KINGBRIGHT: KA-3528ASYC Source: www.kingbright.com
PAD1-PAD8 = wirepad:1,6/0,9: THROUGH-HOLE PAD
R1-R21 R23 R25 R31-R33 R39 R40 SJ100 SJ104 SJ108 SJ110 SJ114 = rcl:R-EU_: RESISTOR, European symbol
U$1-U$3 U$5-U$7 U$9 U$10 U$12 U$14 U$15 = FDMS8558S:FDMS8558S
U$4 U$8 U$11 U$13 = SparkFun-AnalogIC:ACS712: Hall-effect-based isolated linear current sensor
U$17 = tps51222:TPS51222RTVT
U$20-U$26 = MAX1614EUA:MAX1614EUA
U$27 = phoenix-1016:PC-6-16/2-G-10.16-1913646
U$105-U$108 = tonu:IRF8252
X1 = con-phoenix-3.81:1727036: MKDS 1/4-3,81 Source: http://eshop.phoenixcontact.de; MF: FARNELL; MPN: 1727036; OC_FARNELL: 3704592; OC_NEWARK: 71C4114
X2 = con-3m:2534-: 3M (TM) Pak 100 4-Wall Header Source: 3M; OC_FARNELL: unknown; OC_NEWARK: unknown
X3 X4 = con-molex:22-23-2031: .100" (2.54mm) Center Header - 3 Pin; MF: MOLEX; MPN: 22-23-2031; OC_FARNELL: 1462950; OC_NEWARK: 30C0862
X5 = con-molex:22-23-2021: .100" (2.54mm) Center Header - 2 Pin; MF: MOLEX; MPN: 22-23-2021; OC_FARNELL: 1462926; OC_NEWARK: 25C3832

## Net classes
0 default: width 0.152 mm, drill 0.3 mm, clearance 0.152 mm
1 power: width 0.508 mm, drill 0.6 mm, clearance 0.178 mm
2 morepower: width 1.016 mm, drill 0.6 mm, clearance 0.178 mm
3 gnd: width 0.305 mm, drill 0.3 mm, clearance 0.178 mm

## Board
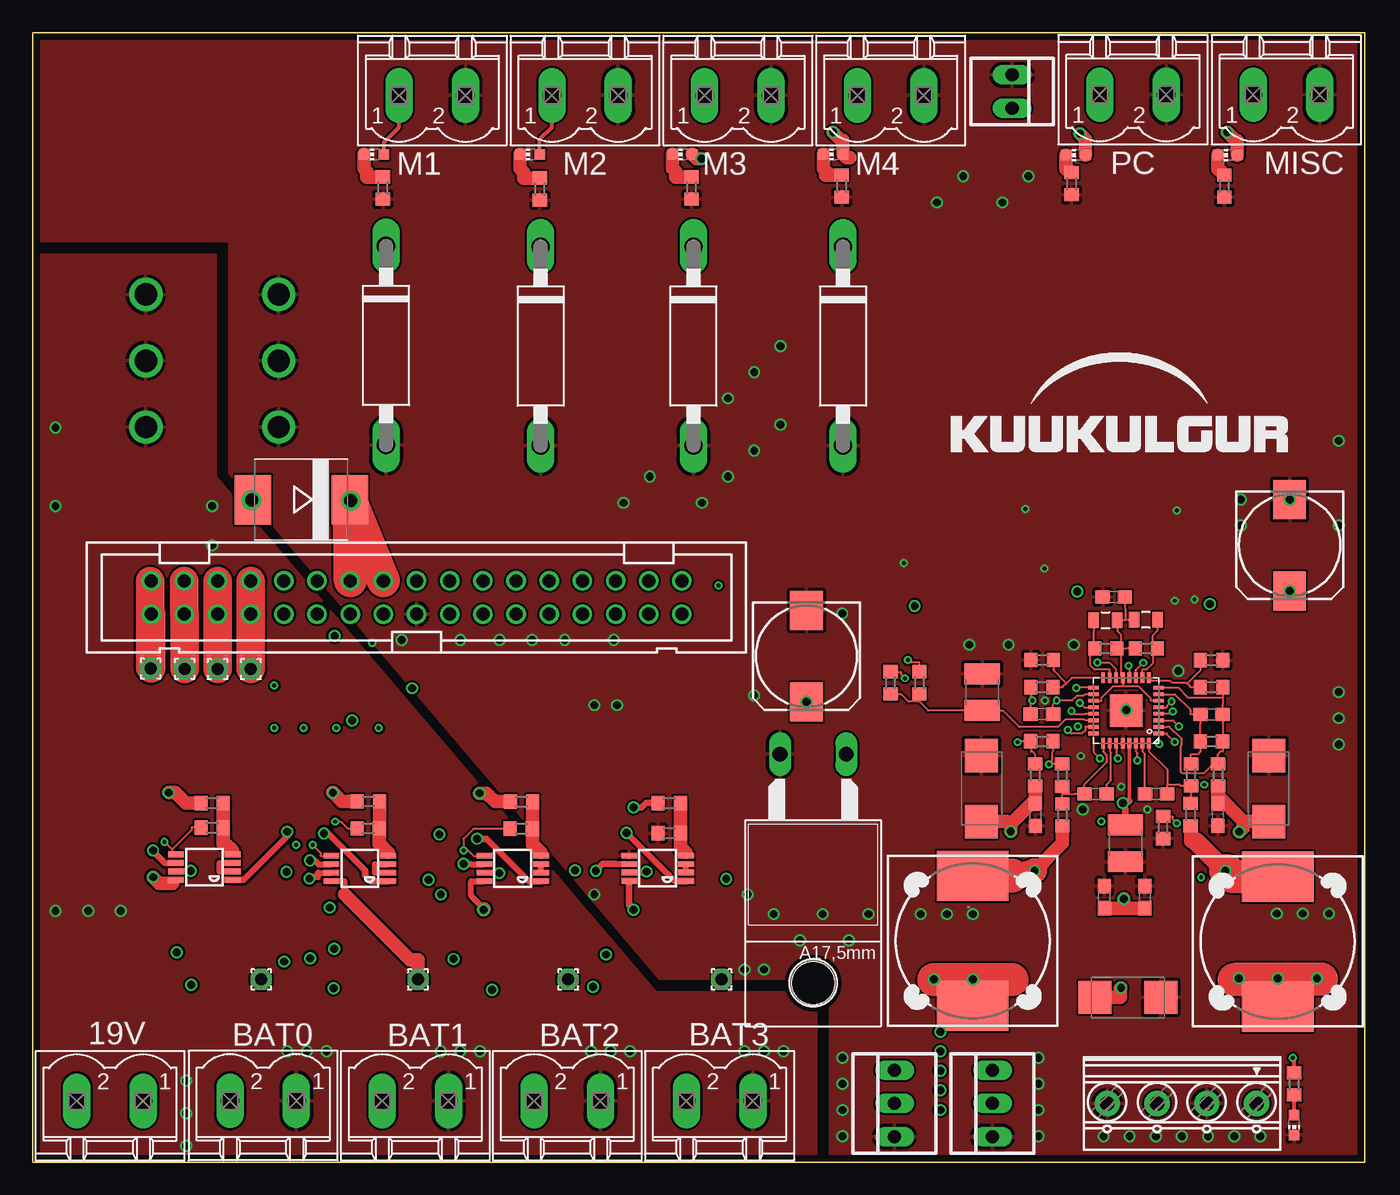
[diagram p5: board, top side]
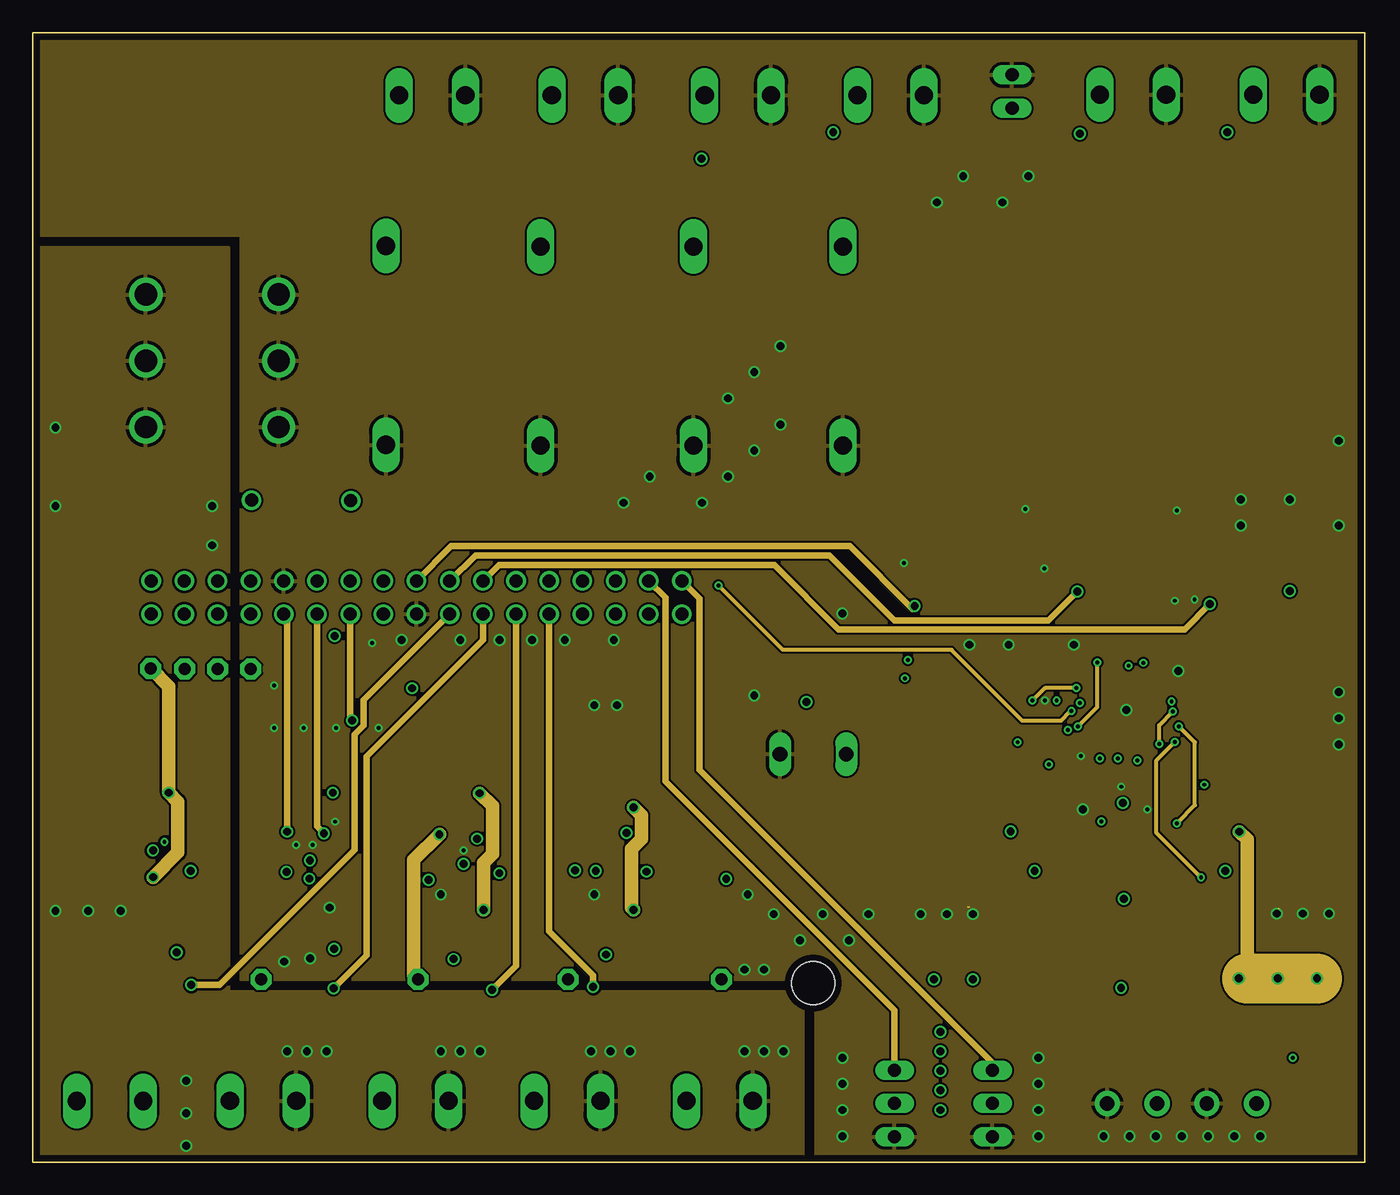
[diagram p6: board, inner layer Route2]
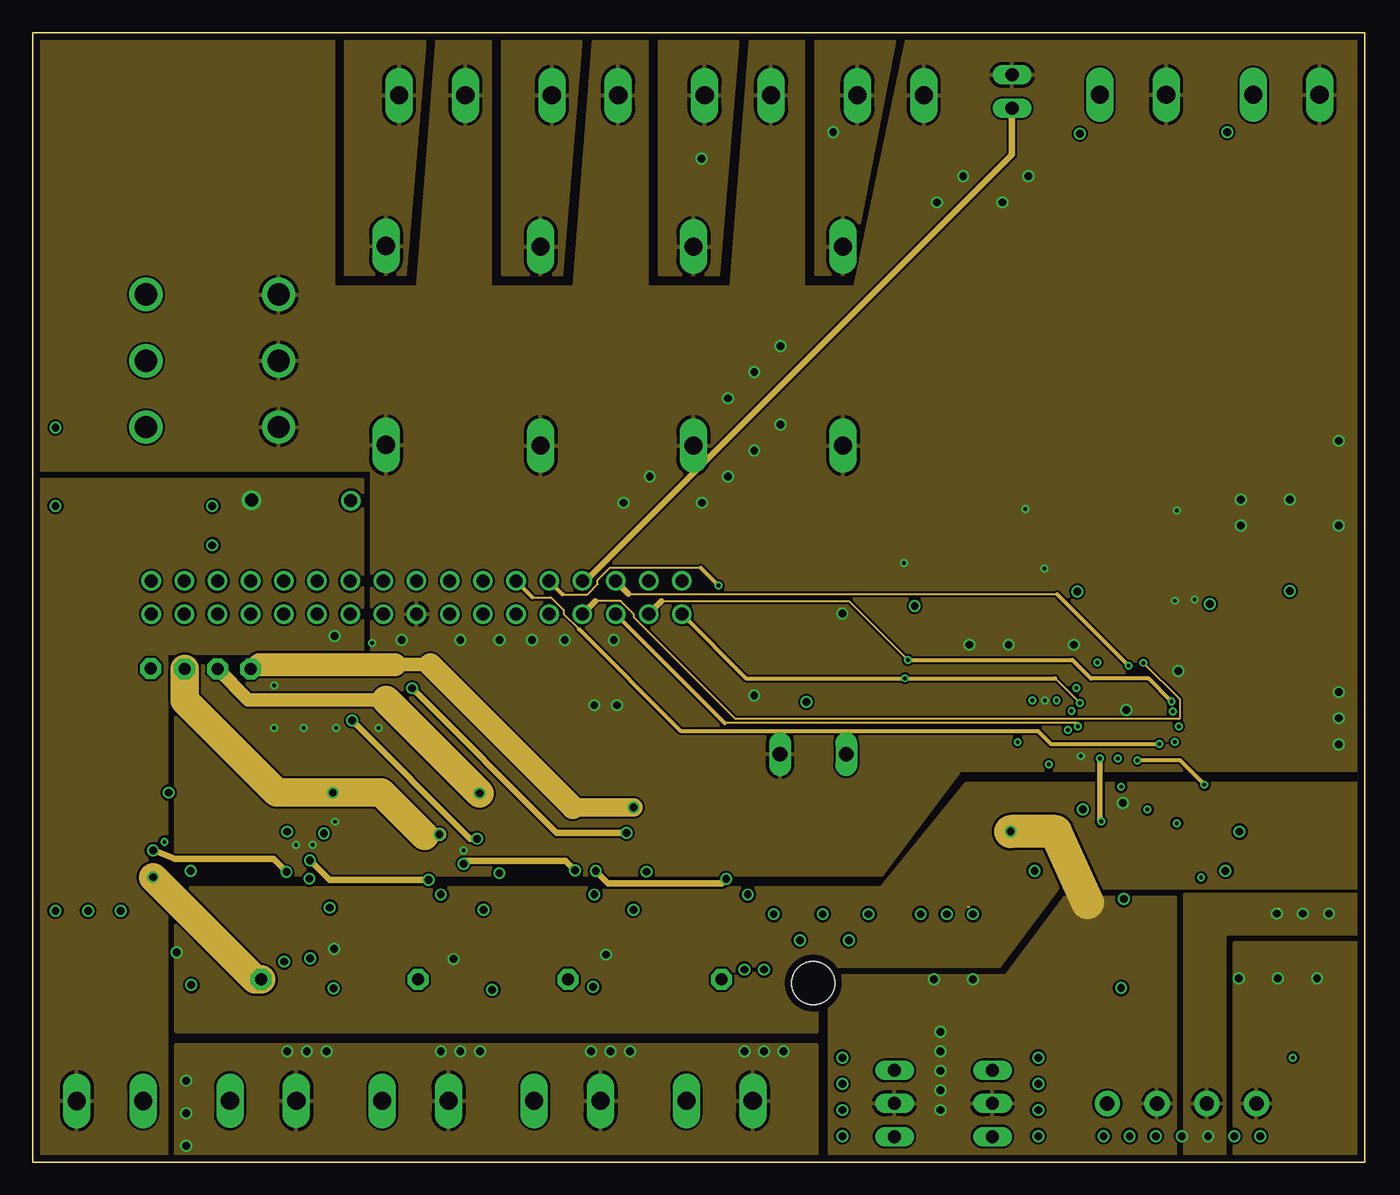
[diagram p7: board, inner layer Route15]
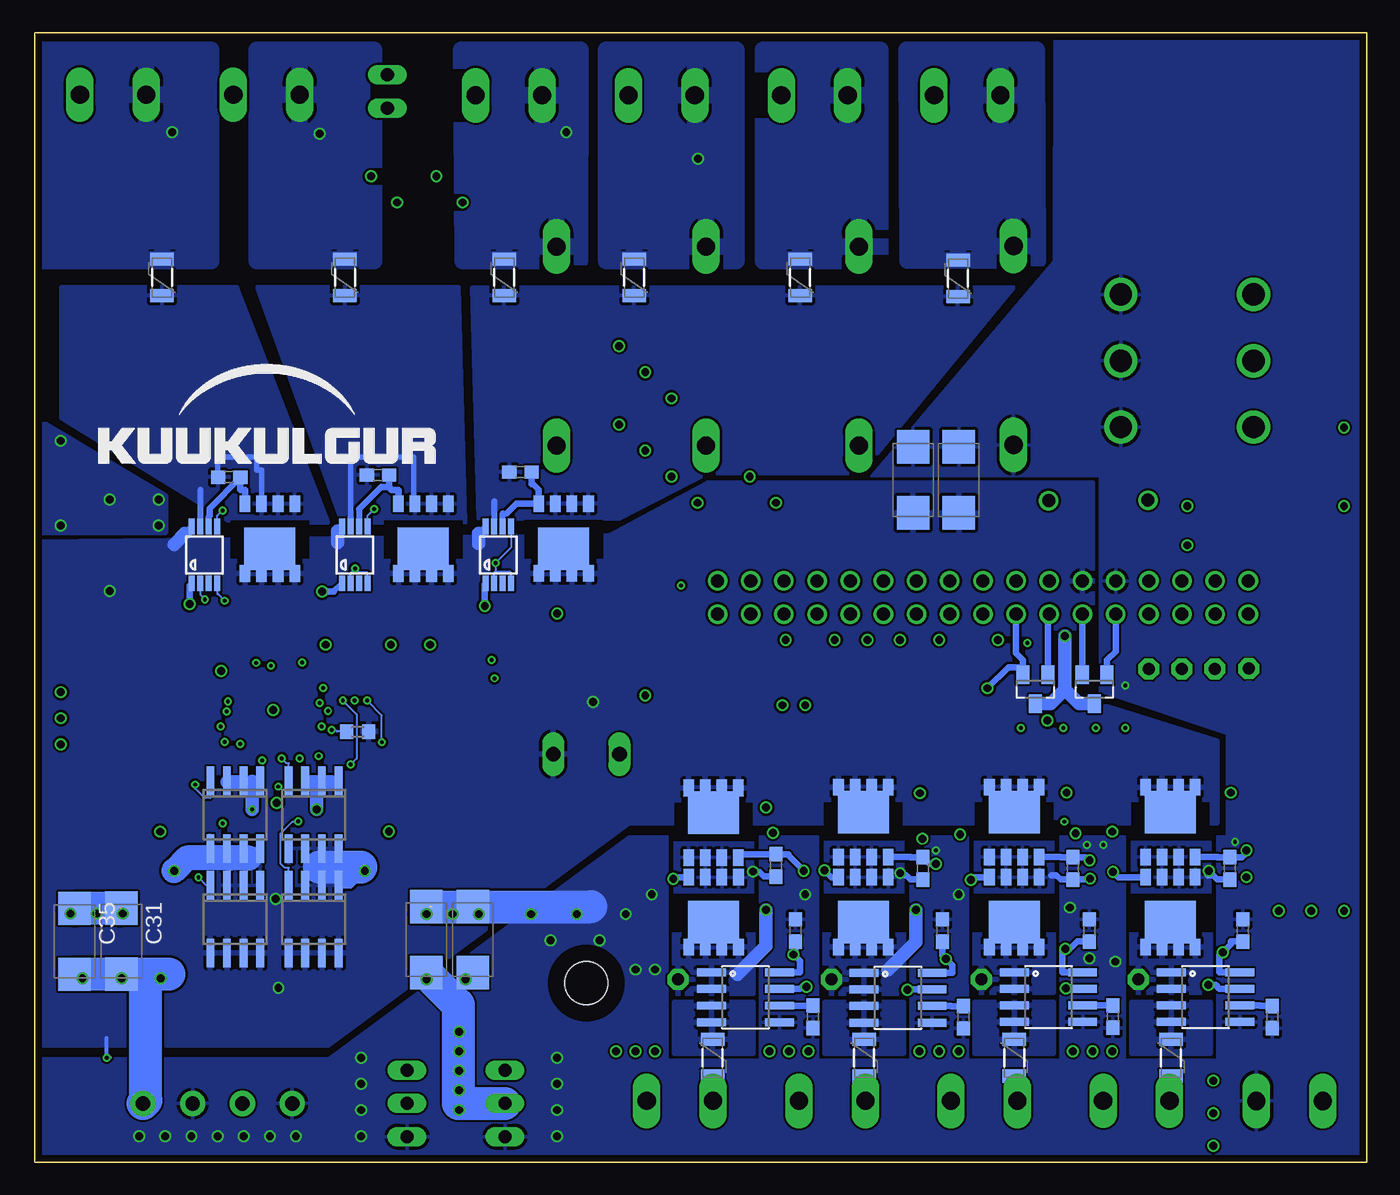
[diagram p8: board, bottom side, seen from below]

Size 102 x 86.5 mm. Coordinates in mm from the lower left corner, seen from the top.
Outline: 0,0 0,86.5 102,86.5 102,0 0,0
Copper layers (1*2+15*16): Top 0.035mm / dielectric 0.6mm / Route2 0.035mm / dielectric 0.15mm / Route15 0.035mm / dielectric 0.6mm / Bottom 0.035mm
Design rules "4mil_4lay2 *": minimum track width 6mil, minimum drill 0.299mm, track to track 6mil, track to pad 6mil, pad to pad 6mil, via to via 6mil, smd to smd 0mil, copper to edge 20mil, drill to drill 8mil, minimum pad ring 8mil, minimum via ring 6mil, stop-mask expansion 4mil, vias tented up to drill 18mil, thermal gap 10mil

### Footprints (pad centres in the part's own frame; a part is rotated, then mirrored left to right if it is on the bottom)
MSTBV2 = drill 1.397 long: 1 -2.54,0; 2 2.54,0
C/6032-28R = smd 2.55 x 2.5: + 2.525,0; - -2.525,0
C0603 = smd 1.1 x 1: 1 -0.85,0; 2 0.85,0
C1210 = smd 1.6 x 2.7: 1 -1.4,0; 2 1.4,0
0805 = smd 0.8 x 1.2: 1 -0.9,0; 2 0.9,0
175TMP-0810 = smd 3 x 2.5: + 3.5,0; - -3.5,0
SOT23 = smd 1 x 1.4: 1 -0.95,-1.1; 2 0.95,-1.1; 3 0,1.1
C1702-15 = drill 1.397 long: A 7.62,0; C -7.62,0
SMC = smd 2.8 x 3.8: A 3.7,0; C -3.7,0
C221B1A = drill 1.118 long: A 2.54,-6.35; C -2.54,-6.35 | hole 3.302: 0,11.176
PTC-1206 = smd 1 x 1.8: 1 -1.4,0; 2 1.4,0
DR125 = smd 3.85 x 5.5: 1 -4.975,0; 2 4.975,0
CHIP-LED0603 = smd 0.8 x 0.8: A 0,-0.75; C 0,0.75
1,6/0,9 = drill 0.914 pad 1.6 octagon: 1 0,0
R0603 = smd 1 x 1.1: 1 -0.85,0; 2 0.85,0
POWER56 = smd 0.81 x 1.27: P$1 -1.905,-2.67; P$2 -0.635,-2.67; P$3 0.635,-2.67; P$4 1.905,-2.67; P$5 1.905,2.67; P$6 0.635,2.67; P$7 -0.635,2.67; P$8 -1.905,2.67 | smd 3.91 x 3.25: P$9 0,0.762
SO08 = smd 0.61 x 2.21: 1 -1.905,-2.616; 2 -0.635,-2.616; 3 0.635,-2.616; 4 1.905,-2.616; 5 1.905,2.616; 6 0.635,2.616; 7 -0.635,2.616; 8 -1.905,2.616
QFN-32 = smd 0.285 x 0.8: P$1 -1.75,-2.5; P$2 -1.25,-2.5; P$3 -0.75,-2.5; P$4 -0.25,-2.5; P$5 0.25,-2.5; P$6 0.75,-2.5; P$7 1.25,-2.5; P$8 1.75,-2.5; P$17 1.75,2.5; P$18 1.25,2.5; P$19 0.75,2.5; P$20 0.25,2.5; P$21 -0.25,2.5; P$22 -0.75,2.5; P$23 -1.25,2.5; P$24 -1.75,2.5 | smd 0.8 x 0.285: P$9 2.5,-1.75; P$10 2.5,-1.25; P$11 2.5,-0.75; P$12 2.5,-0.25; P$13 2.5,0.25; P$14 2.5,0.75; P$15 2.5,1.25; P$16 2.5,1.75; P$25 -2.5,1.75; P$26 -2.5,1.25; P$27 -2.5,0.75; P$28 -2.5,0.25; P$29 -2.5,-0.25; P$30 -2.5,-0.75; P$31 -2.5,-1.25; P$32 -2.5,-1.75 | smd 2.5 x 2.5: P$33 0,0
MAX1614EUA = smd 0.45 x 1.2: 1 -0.975,-2.175; 2 -0.325,-2.175; 3 0.325,-2.175; 4 0.975,-2.175; 5 0.975,2.175; 6 0.325,2.175; 7 -0.325,2.175; 8 -0.975,2.175
PC-6-16/2-G-10.16 = drill 1.7: P$1 -5.08,0; P$2 -5.08,-5.08; P$3 -5.08,-10.16; P$4 5.08,0; P$5 5.08,-5.08; P$6 5.08,-10.16
SO8 = smd 0.6 x 2.2: 1 -1.905,-2.6; 2 -0.635,-2.6; 3 0.635,-2.6; 4 1.905,-2.6; 5 1.905,2.6; 6 0.635,2.6; 7 -0.635,2.6; 8 -1.905,2.6
1727036 = drill 1.1 pad 1.93: 1 -5.715,0; 2 -1.905,0; 3 1.905,0; 4 5.715,0
PAK100/2500-34 = drill 1 pad 1.422: 1 -20.32,-1.27; 2 -20.32,1.27; 3 -17.78,-1.27; 4 -17.78,1.27; 5 -15.24,-1.27; 6 -15.24,1.27; 7 -12.7,-1.27; 8 -12.7,1.27; 9 -10.16,-1.27; 10 -10.16,1.27; 11 -7.62,-1.27; 12 -7.62,1.27; 13 -5.08,-1.27; 14 -5.08,1.27; 15 -2.54,-1.27; 16 -2.54,1.27; 17 0,-1.27; 18 0,1.27; 19 2.54,-1.27; 20 2.54,1.27; 21 5.08,-1.27; 22 5.08,1.27; 23 7.62,-1.27; 24 7.62,1.27; 25 10.16,-1.27; 26 10.16,1.27; 27 12.7,-1.27; 28 12.7,1.27; 29 15.24,-1.27; 30 15.24,1.27; 31 17.78,-1.27; 32 17.78,1.27; 33 20.32,-1.27; 34 20.32,1.27
22-23-2031 = drill 1 long: 1 -2.54,0; 2 0,0; 3 2.54,0
22-23-2021 = drill 1 long: 1 -1.27,0; 2 1.27,0

### Placement (x,y rotation side)
19V  5.92,4.69 180 top
BAT0  17.65,4.71 180 top
BAT1  29.3,4.7 180 top
BAT2  40.94,4.7 180 top
BAT3  52.6,4.7 180 top
C1  94.65,28.62 270 top
C2  72.65,28.62 270 top
C3  83.86,12.62 180 top
C4  30.9,11.11 90 bottom
C5  83.67,24.42 90 top
C6  34,22.5 90 bottom
C7  42.4,11.14 90 bottom
C8  86.02,28.2 0 top
C9  45.24,22.73 90 bottom
C10  82.78,43.3 180 top
C11  19.43,11.15 90 bottom
C12  22.5,22.5 90 bottom
C15  72.02,17.04 270 bottom
C16  90.27,34.3 180 top
C17  72.71,35.99 270 top
C18  7.22,11.11 90 bottom
C19  10.5,22.5 90 bottom
C20  77.27,34.31 0 top
C21  81.4,28.21 180 top
C22  75.72,52.63 0 bottom
C23  87.11,52.45 0 bottom
C24  64.81,52.85 0 bottom
C25  9.5,17.75 270 bottom
C26  21.25,17.75 270 bottom
C27  32.5,17.75 270 bottom
C28  43.75,17.75 270 bottom
C29  85.15,20.3 270 top
C30  68.45,17.04 270 bottom
C31  95.37,16.93 270 bottom
C32  82.05,20.3 90 top
C33  82.15,41.51 0 top
C34  85.23,41.53 180 top
C35  98.95,16.91 270 bottom
C36  34.75,52.25 270 bottom
C37  31.25,52.25 270 bottom
C38  96.25,47.25 270 top
C39  59.25,38.75 270 top
C104  76.77,26.6 270 top
C113  90.75,26.61 270 top
D1  20.85,36.22 180 bottom
D2  27.05,62.55 270 top
D3  25.38,36.22 180 bottom
D4  20.57,50.74 180 top
D20  59.76,24.9 180 top
D21  38.9,62.5 270 top
D22  50.6,62.5 270 top
D23  62.05,62.5 270 top
F1  78.25,67.75 90 bottom
F2  92.25,67.75 90 bottom
F3  15,8 270 bottom
F4  27,8 270 bottom
F5  38.5,8 270 bottom
F6  50.1,8 270 bottom
F7  31.3,67.67 90 bottom
F8  43.4,67.75 90 bottom
F9  56.1,67.75 90 bottom
F10  66.05,67.75 90 bottom
L1  95.33,16.89 90 top
L2  71.98,16.95 270 top
LED1  26.15,77.17 90 top
LED2  38.08,77.17 90 top
LED3  49.75,77.17 90 top
LED4  61.3,77.17 90 top
LED5  79.88,77.12 90 top
LED6  91.5,77.12 90 top
M1  30.6,81.7 0 top
M2  42.3,81.7 0 top
M3  54,81.7 0 top
M4  65.7,81.7 0 top
MISC  96,81.75 0 top
PAD1  17.5,14 0 top
PAD2  29.5,14 0 top
PAD3  41,14 0 top
PAD4  52.75,14 0 top
PAD5  16.7,37.77 0 top
PAD6  14.15,37.77 0 top
PAD7  11.64,37.78 0 top
PAD8  9.04,37.8 0 top
PC  84.25,81.75 0 top
PWRLED  96.59,2.85 180 top
R1  79.55,74.93 90 top
R2  91.25,74.75 90 top
R3  86.54,25.63 90 top
R4  90.27,38.44 180 top
R5  77.29,38.46 0 top
R6  26.82,74.6 90 top
R7  38.83,74.53 90 top
R8  50.45,74.6 90 top
R9  61.95,74.75 90 top
R10  67.9,36.71 90 top
R11  13.75,27.5 180 top
R12  96.59,6.01 90 top
R13  13.74,25.62 0 top
R14  65.69,36.71 90 top
R15  25.71,27.63 180 top
R16  25.69,25.56 0 top
R17  37.43,27.62 180 top
R18  37.41,25.53 0 top
R19  48.75,27.5 180 top
R20  48.75,25.2 0 top
R21  90.27,36.37 0 top
R23  85.27,39.35 180 top
R25  90.26,32.23 0 top
R31  88.69,29.66 270 top
R32  78.84,29.64 270 top
R33  77.27,32.23 0 top
R39  82.18,39.34 180 top
R40  77.27,36.38 180 top
SJ100  76.76,29.66 270 top
SJ104  77.28,32.97 0 bottom
SJ108  88.67,26.61 270 top
SJ110  78.84,26.6 270 top
SJ114  90.76,29.67 270 top
U$1  61.5,47.76 180 bottom
U$2  50.02,26 0 bottom
U$3  50.02,19.15 180 bottom
U$4  47.58,12.63 270 bottom
U$5  15.05,26.05 0 bottom
U$6  38.55,26.05 0 bottom
U$7  38.55,19.16 180 bottom
U$8  35.9,12.6 270 bottom
U$9  27,26.05 0 bottom
U$10  27,19.16 180 bottom
U$11  24.38,12.65 270 bottom
U$12  15.05,19.16 180 bottom
U$13  12.36,12.65 270 bottom
U$14  72.25,47.75 180 bottom
U$15  84,47.75 180 bottom
U$17  83.72,34.59 90 top
U$20  13.15,22.59 90 top
U$21  36.75,22.5 90 top
U$22  25.05,22.5 90 top
U$23  47.85,22.51 90 top
U$24  66.5,46.5 0 bottom
U$25  77.5,46.5 0 bottom
U$26  89,46.5 0 bottom
U$27  13.75,56.29 180 top
U$105  86.65,18.62 180 bottom
U$106  86.65,26.62 180 bottom
U$107  80.65,26.62 180 bottom
U$108  80.65,18.62 180 bottom
X1  88,4.5 180 top
X2  29.4,43.25 0 top
X3  73.5,4.5 90 top
X4  66,4.5 90 top
X5  75,82 270 top

### Tracks (layer width: path | path; a pad name or v marks a point on that pad's centre or on a via)
5V_LDO  (via drill 0.6 pad 0.9)
  Top 0.284: 83.97,27.68 U$17.P$29
  Top 0.508: 83.97,27.68 83.8,27.5 v83.47,27.5 83.47,27.26 83.67,27.05 C5.2
  Bottom 0.508: U$4.8 43.43,14.54 43.43,15.42 v43.91,15.9 43.89,15.92 43.75,15.92 C28.2 | C25.2 10.43,16.9 10.43,16.68 v11.04,16.08 11.28,15.84 11.28,14.55 U$13.8 | C27.2 32.5,15.82 v32.24,15.56 31.75,15.07 31.75,14.5 U$8.8 | C26.2 22.18,16.9 22.73,16.35 v23.09,16.35 23.3,16.14 23.3,14.55 U$11.8
  pour Route15: 74,15 60,15 60,10 11,10 11,21 65,21 71.5,29 102,29 102,21 78.5,21
!OFF_0
  Top 0.45: U$20.2 14.32,22.27 14.32,22.92 U$20.3
!OFF_1
  Top 0.45: U$22.2 26.22,22.18 26.22,22.82 U$22.3
!OFF_2
  Top 0.45: U$21.2 U$21.3
!OFF_3
  Top 0.45: U$23.2 U$23.3
+5V  (via drill 0.6, 0.6 pad 0.9)
  Top 1.016: v92.41,25.31 92.71,25.62 92.71,26.09 | C1.+ 92.71,26.09 | 90.75,28.08 92.71,26.11 92.71,26.09 | 90.75,28.08 90.75,28.7 90.76,28.71 SJ114.2 | C113.1 90.75,28.08 | v92.35,14.07 92.5,14
  Top 1.422: L1.1 arc90 95.35,11.94 v95.35,14.07
  Top 2.54: 93.89,14 98.68,14.03 92.5,14 92,14
  Route2 1.016: v92.41,25.31 93,24.72 93,21 93,14.07
  Route2 3.81: 93,14.07 v98.35,14.07
  Bottom 1.016: C31.+ 95.5,14.5 v95.35,14.07
  Bottom 2.54: 91.71,14.39 93.5,14.39 | 93.5,14.39 C35.+ | X1.1 93.5,4.72 93.5,14.39
  pour Route15: 92,16.75 92,0 102,0 102,16.75
+19V  (via drill 0.6 pad 0.9, 1 pad 1.5)
  Bottom 1.016: D1.3 22.04,35.12 23.12,36.2 | D3.3 24.2,35.12 | 24.2,35.12 | 24.2,35.12 23.12,36.2 | v23.12,40.3 23.12,36.2
  other vias: 16.76,50.69
  pour Route15: 25.25,52.25 0,52.25 0,0 10.25,0 10.25,39 25.25,39
+19V_CHG  (via drill 1 pad 1.5)
  Top 0.152: v24.36,50.66 24.35,50.66 D4.C
  Top 2.54: X2.16 v24.36,50.66 | X2.14 D4.C
BAT0_EN  (via drill 0.6 pad 0.9)
  Top 0.45: U$20.1
  Top 0.508: v19.49,25.31 19.49,24.94 16.17,21.61 U$20.1
  Route2 0.508: X2.9 19.49,41.72 v19.49,25.31
  Bottom 0.508: X2.9 19.23,39.12 19.9,38.46 D1.1
BAT0_G  (via drill 0.6 pad 0.9)
  Top 0.45: 10.11,22.92 U$20.6
  Top 0.508: v9.22,23.88 9.22,23.81 10.11,22.92
  Route15 0.45: 10.88,23.22 v9.22,23.88
  Route15 0.508: v19.44,22.22 18.44,23.22 10.88,23.22
  Bottom 0.508: U$5.P$4 11.46,23.38 11.43,23.35 C19.2 9.57,23.35 9.22,23.7 v9.22,23.88 | U$12.P$4 19.04,21.83 v19.44,22.22
BAT0_S  (via drill 0.6 pad 0.9)
  Top 0.45: 12,22.27 U$20.7
  Top 0.508: 12,22.27 12.04,22.27 v12.1,22.32
  Bottom 0.508: 12.19,21.96 11.74,21.96 11.43,21.65 C19.1
  pour Bottom: 18,20.5 18,25 12,25 12,20.5
BAT1_EN  (via drill 0.6 pad 0.9)
  Top 0.45: U$22.1
  Top 0.508: v22.3,25.19 22.62,25.19 25.45,22.36 25.45,21.98 25.91,21.52 U$22.1
  Route2 0.508: X2.11 21.78,25.72 v22.3,25.19
  Bottom 0.508: X2.11 21.8,41.95 D1.2
BAT1_G  (via drill 0.6 pad 0.9)
  Top 0.45: 21.65,23.07 21.87,22.85 21.87,22.82 U$22.6
  Top 0.508: 21.65,23.07 | 21.65,23.07 21.28,23.07 v21.23,23.12
  Route15 0.508: v30.31,21.62 22.73,21.62 v21.23,23.12
  Bottom 0.508: U$9.P$4 23.46,23.38 23.43,23.35 C12.2 21.57,23.35 21.34,23.12 v21.23,23.12 | U$10.P$4 30.11,21.83 v30.31,21.62
BAT1_S  (via drill 0.6 pad 0.9)
  Top 0.45: 21.84,21.84 21.84,22.15 21.87,22.18 U$22.7
  Top 0.508: 21.84,21.84 21.31,21.84 v21.19,21.72
  Bottom 0.508: 24.17,21.98 23.76,21.98 23.43,21.65 C12.1 21.57,21.65 21.5,21.72 v21.19,21.72
  pour Bottom: 24,25 24,20.5 30,20.5 30,25
BAT2_EN  (via drill 0.6 pad 0.9)
  Top 0.45: U$21.1
  Top 0.508: v34.02,24.77 34.77,24.77 38.02,21.52 U$21.1
  Route2 0.508: X2.13 24.32,33.96 v24.46,33.82
  Route15 0.508: v24.46,33.82 33.51,24.77 v34.02,24.77
  Bottom 0.508: X2.13 24.43,41.86 D3.1
BAT2_G  (via drill 0.6 pad 0.9)
  Top 0.45: v32.99,22.84 33.56,22.84 33.57,22.82 U$21.6
  Route15 0.508: v32.99,22.84 33.22,23.06 40.8,23.06 v41.52,22.34
  Bottom 0.508: v41.52,22.34 41.01,21.83 U$7.P$4 | v32.99,22.84 33.49,22.84 C6.2 34.93,23.35 34.96,23.38 U$6.P$4
BAT2_S  (via drill 0.6 pad 0.9)
  Top 0.45: 35.61,22.18 U$21.7
  Top 0.508: 35.61,22.18 35.7,22.18 v35.74,22.14
  Bottom 0.508: 35.69,21.95 35.24,21.95 34.93,21.65 C6.1
  pour Bottom: 35.5,25 35.5,20.5 41.5,20.5 41.5,25
BAT3_EN  (via drill 0.6 pad 0.9)
  Top 0.45: U$23.1
  Top 0.508: v45.48,25.23 49.18,21.52 U$23.1
  Route15 0.508: v29.05,36.3 40.12,25.23 v45.48,25.23
  Bottom 0.508: X2.15 26.86,38.98 26.33,38.46 26.33,37.89 | D3.2 26.33,37.89 | 26.33,37.89 27.46,37.89 v29.05,36.3
BAT3_G  (via drill 0.6 pad 0.9)
  Top 0.45: 44.64,22.83 U$23.6
  Top 0.508: 44.64,22.83 43.63,22.83 v43.12,22.32
  Route15 0.508: v53.11,21.71 52.77,21.36 44.08,21.36 v43.12,22.32
  Bottom 0.508: U$2.P$4 47.86,23.58 C9.2 44.3,23.58 44.3,23.51 v43.12,22.32 | U$3.P$4 53,21.82 v53.11,21.71
BAT3_S  (via drill 0.6 pad 0.9)
  Top 0.45: U$23.7 46.67,22.18 46.69,22.19 47.01,22.19
  Top 0.508: v47.01,22.25 47.01,22.19
  Bottom 0.508: 47.18,22.23 46.51,22.23 46.17,21.88 C9.1
  pour Bottom: 47,25 47,20.5 53,20.5 53,25
BAT-  (via drill 0.6 pad 0.9)
  other vias: 1.75,50.25 1.75,56.25 13.75,50.25 13.75,47.25 57.5,8.5 56,8.5 54.5,8.5 44.25,8.5 42.75,8.5 45.75,8.5 32.75,8.5 31.25,8.5 34.25,8.5 1.75,19.25 4.25,19.25 6.75,19.25 21,8.5 19.5,8.5 22.5,8.5 11.75,6.25 11.75,3.75 11.75,1.25
  pour Top: 0.25,0.5 60,0.5 60,13 47.75,13 14,52.5 14,69.5 0.25,69.5
  pour Route2: 0,0.5 59,0.5 59,13 15,13 15,70 0.25,70
  pour Route15: 11,9 60,9 60,0 11,0
COMP1
  Top 0.152: U$17.P$10 84.97,37.72 85.28,37.72 85.76,38.19 85.76,39.34 | C34.1 86.13,40.7 85.76,40.33 85.76,39.34 | R23.1 85.76,39.34
COMP2
  Top 0.152: 81.25,39.34 R39.2 | 81.25,39.34 80.97,39.06 80.97,38.04 81.3,37.72 82.47,37.72 U$17.P$15 | 81.25,39.34 81.25,40.68 C33.1
COMPUTER_PWR
  Route15 0.508: X5.2 75,77.16 42.35,44.52 X2.28
CSN1
  Top 0.152: 90.76,30.88 89.66,29.79 88.03,29.79 87.91,29.91 87.91,31.88 87.98,31.95 87.98,32.41 87.05,33.34 86.85,33.34 U$17.P$2 | 90.76,30.88 90.76,31.25 90.96,31.45 91.11,31.45 R25.2 91.11,33.56 91.12,33.57 C16.1 91.12,35.03 91.12,35.59 | SJ114.1 90.76,30.88 | U$17.P$8 87.72,36.34 88.46,35.59 91.12,35.59 | R21.2 91.12,35.59
CSN2  (via drill 0.3 pad 0.6)
  Top 0.152: U$17.P$17 79.94,36.34 v79.92,36.32 | R40.2 76.42,35.6 76.54,35.49 v76.54,35.35 76.54,35.16 76.42,35.04 C20.1 | v75.42,32.16 75.62,32.16 75.69,32.23 R33.1 76.42,31.45 76.55,31.45 76.76,31.23 SJ100.1
  Route2 0.305: v79.92,36.32 77.51,36.32 v76.54,35.35
  Bottom 0.152: v75.42,32.16 75.42,34.23 v76.54,35.35
CSP1
  Top 0.152: R31.1 88.69,31.24 89.21,31.24 89.41,31.45 R25.1 89.41,33.56 89.42,33.57 C16.2 88.64,34.3 88.64,34.66 87.47,35.84 86.85,35.84 U$17.P$7
CSP2  (via drill 0.3 pad 0.6)
  Top 0.152: U$17.P$18 80.59,35.84 80.47,35.72 79.96,35.72 79.59,35.35 v78.41,35.35 78.41,35.32 78.12,35.04 C20.2 | R33.2 78.12,31.45 78.06,31.39 78.06,30.49 | R32.1 78.06,30.49 | v77.8,30.46 78.03,30.46 78.06,30.49
  Bottom 0.152: v78.41,35.35 77.35,34.29 77.35,30.91 v77.8,30.46
DRVH1  (via drill 0.3 pad 0.6)
  Top 0.152: U$17.P$1 86.85,32.84 86.85,32.77 v87.45,32.17
  Route2 0.305: v89.47,21.81 86.06,25.22 86.06,30.77 v87.45,32.17
  Bottom 0.152: U$105.4 88.87,21.22 v89.47,21.81
DRVH2  (via drill 0.3 pad 0.6)
  Top 0.152: U$17.P$24 81.22,31.43 v81.73,30.92
  Route15 0.152: 81.73,26.18 v81.82,26.09
  Route15 0.406: v81.73,30.92 81.73,26.18
  Bottom 0.152: v81.82,26.09 82.24,26.09 83.16,25.17 83.16,22.84 82.87,22.55 82.55,22.55 U$108.4
DRVL1  (via drill 0.3 pad 0.6)
  Top 0.152: v84.6,30.77 84.6,31.33 84.47,31.46 U$17.P$30
  Route15 0.305: v89.72,28.91 87.86,30.77 v84.6,30.77
  Bottom 0.152: U$106.4 88.55,27.89 88.99,27.89 89.72,28.62 v89.72,28.91 | v89.72,28.91
DRVL2  (via drill 0.3 pad 0.6)
  Top 0.152: U$17.P$27 82.97,31.06 v83.1,30.93
  Bottom 0.152: v83.1,30.93 82.71,30.55 82.55,30.55 U$107.4
ENABLE_PWR  (via drill 0.3 pad 0.6)
  Top 0.152: v83.92,38.02 83.97,37.97 U$17.P$12
  Route15 0.152: 45.64,43.51 78.43,43.51
  Route15 0.305: 78.43,43.51 v83.92,38.02
  Route15 0.406: X2.30 45.64,43.51
GND  (via drill 0.3, 0.3 pad 0.6, 0.6, 0.6 pad 0.6, 0.6 pad 0.9)  (2 unrouted)
  Top 0.152: U$21.5 33.75,23.48 33.33,23.89 v32.99,23.89 32.99,24.78 33.75,25.54 R18.1 | R13.1 12.16,25.62 12.16,25.45 10.68,23.97 | v10.09,24.54 v10.1,24.54 10.68,23.97 | U$20.5 10.68,23.86 10.68,23.97 | v21.43,24.3 22.04,23.68 22.04,23.48 U$22.5 | v23.17,26.08 23.59,26.08 24.12,25.56 R16.1
  Bottom 0.152: U$107.1 79.24,29.14 | 80.01,28.55 79.85,29.14 | 80.01,28.55 80.01,29.14 | U$107.2 80.01,29.14 | 80.01,29.14 80.01,28.55 | 80.41,29.14 80.01,29.14 | 81.12,29.14 81.28,28.55 U$107.3 | U$24.5 65.53,47.09 v66.72,45.89 66.72,45.25 | 66.72,45.25 66.83,45.15 U$24.2 | 66.72,45.25 65.62,45.25 65.53,45.15 U$24.4 | U$26.5 88.03,49.5 88.02,49.5 v87.62,49.9 | U$25.5 76.53,49.5 76.52,49.5 v76.01,50.01 | U$25.4 76.53,45.15 77.15,45.15 v77.47,45.48 77.79,45.15 77.83,45.15 U$25.2 | U$26.2 89.33,43.46 v88.97,43.1 | U$26.4 88.03,43.5 87.96,43.5 v87.46,43 | 85.36,29.14 85.36,29.15 | 86.01,29.05 85.36,29.15 | 85.36,29.15 85.36,29.14 | 85.36,29.14 84.74,29.14 U$106.1 | 86.01,29.05 86.01,29.14 | U$106.2 86.01,29.14 | 86.01,29.14 86.01,29.05 | U$106.3 87.28,29.14 | C31.- 95.5,19.25 v95.27,19.04
  Bottom 1.016: 79.85,29.14 79.24,29.14 | v80.41,27.02 80.41,29.14 81.12,29.14 | 85.36,29.15 v85.36,27.02 | 87.28,29.14 86.01,29.14
  Bottom 1.422: 71.56,19.57 C15.- | C15.- 71.56,19.57 | 71.56,19.57 C30.- | C15.- arc90 72.59,19
  Bottom 2.54: C30.- | 95.46,19.44 C35.- | 71.75,19.57 59.43,19.57
  other vias: 45.25,50.5 47.25,52.5 53.25,58.5 55.25,60.5 57.25,62.5 51.25,50.5 53.25,52.5 55.25,54.5 57.25,56.5 28.25,40 32.75,40 35.75,40 38.25,40 40.75,40 44.5,40 55.25,35.75 44.75,35 43,35 54.5,14.75 56,14.75 83.74,34.63 87.74,37.63 79.74,39.63 74.74,39.63 71.74,39.63 61.99,42.02 71.25,75.5 76.25,75.5 69.25,73.5 74.25,73.5 62,8 62,6 62,4 62,2 77,8 77,6 77,4 77,2 60.5,19 62.5,17 64,19 82,2 84,2 86,2 88,2 90,2 92,2 94,2 100,32 100,34 100,36 72,19 70,19 68,19 97.26,19.04 99.26,19.04 92.5,50.75 100,55.25 96.25,50.75 100,48.75 22.75,19.5 21.26,15.62 19.26,15.37 20.18,24.3 31.25,20.5 43,20.5 54.75,20.5 92.5,48.75 18.5,36.5 26,39.75 26.5,33.25 23.25,33.25 20.75,33.25 18.5,33.25 56.75,19 58.75,17 77.5,35.35 80.25,31.1 83.35,28.76
  pour Top: 102,86.5 102,0.5 61,0.43 61,14 48,14 15,52.75 15,70.5 0,70.5 0,86.5
  pour Bottom: 23.97,86.53 24,69 38,52.5 20.5,52.5 20.5,36 10.75,32.75 10.75,25 11.5,25 11.5,7.9 18.5,7.9 18.5,25 23.5,25 23.5,7.9 30.5,7.9 30.5,25 35,25 35,7.9 42,7.9 42,25 46.5,25 46.5,7.9 53.5,7.9 53.5,25 56.5,25 79.5,8 101.75,8 101.75,0 0,0 0,86.5
  pour Route15: 0,86 23,86 23,67 29.5,67 31,86 35,86 35,67 41.5,67 43,86 47,86 47,67 53.5,67 55,86 59,86 59,67 63,67 67,86 102,86 102,30 71,30 65,22 11,22 11,38 26,38 26,53 0,53
  pour Route2: 0,87 102,87 102,0 60,0 60,14 16,14 16,71 0,71
  pour Route15: 101.75,20.5 101.75,17.5 91.25,17.5 91.25,0.25 88.25,0.25 88.25,20.5
  pour Bottom: 102,48.25 92,48.25 92,51 102,57
IBAT0_AD  (via drill 0.6 pad 0.9)
  Route2 0.508: v12.15,13.58 14.33,13.58 24.65,23.9 24.65,32.76 25.34,33.45 25.34,35.38 X2.19
  Bottom 0.508: v12.15,13.58 11.58,13.58 11.28,13.28 U$13.7
IBAT1_AD  (via drill 0.6 pad 0.9)
  Route2 0.508: X2.21 34.48,39.98 25.57,31.08 25.57,15.85 v23.04,13.32
  Bottom 0.508: v23.04,13.32 21.79,13.32 U$11.7
IBAT2_AD  (via drill 0.6 pad 0.9)
  Route2 0.508: X2.23 37.02,15.04 v35.18,13.21
  Bottom 0.508: v35.18,13.21 34.85,13.21 34.82,13.23 U$8.7
IBAT3_AD  (via drill 0.6 pad 0.9)
  Route2 0.508: X2.25 39.56,17.69 42.92,14.33 v42.92,13.42
  Bottom 0.508: v42.92,13.42 43.27,13.42 43.43,13.27 U$4.7
IMON1  (via drill 0.3 pad 0.6)
  Top 0.152: U$17.P$11 84.47,37.72 84.52,37.72 v85.06,38.25
  Route15 0.152: v85.06,38.25 87.83,35.47 87.83,34.01 arc-90 87.75,33.93 53.83,33.93 46.05,41.72 46.05,41.96 45.02,42.99 43.11,42.99
  Route15 0.406: 43.11,42.99 X2.27
IMON2  (via drill 0.3 pad 0.6)
  Top 0.152: U$17.P$14 82.97,37.72 82.43,38.26 v81.52,38.26
  Route2 0.305: v80.03,33.36 81.52,34.85 v81.52,38.26
  Route15 0.152: v80.03,33.36 80.08,33.41 80.08,33.62 52.99,33.62
  Route15 0.305: 52.99,33.62 X2.29
LBI0
  Top 0.45: 15.32,23.83 U$20.4
  Top 1.016: 15.32,23.83 14.76,24.39 14.59,24.39 14.59,25.01 | R13.2 14.59,25.01 | 14.59,25.01 14.6,25.02 R11.1
LBI1
  Top 0.45: 27.22,23.74 U$22.4
  Top 1.016: 27.22,23.74 26.63,24.33 26.54,24.33 26.54,24.94 | R16.2 26.54,24.94 | 26.54,24.94 26.56,24.95 R15.1
LBI2
  Top 0.45: 38.92,23.74 U$21.4
  Top 1.016: 38.92,23.74 38.36,24.3 38.26,24.3 R18.2 38.26,26.77 38.28,26.79 R17.1
LBI3
  Top 0.45: 50.02,23.74 U$23.4
  Top 1.016: 50.02,23.74 49.8,23.96 49.6,23.96 R20.2 R19.1
N$1
  Top 1.016: R6.2 25.59,75.45 25.59,75.9 25.4,76.09 LED1.C
N$4
  Top 1.016: R7.2 37.59,75.38 37.59,75.83 37.33,76.09 LED2.C
N$5
  Top 0.152: 88.41,36.65 88.36,36.7 87.27,36.7 87.1,36.86 85.7,36.86 U$17.P$9 | 88.41,36.65 88.69,36.37 R21.1 | 88.41,36.65 89.42,37.66 R4.2
N$7
  Top 1.016: R8.2 49.21,75.45 49.21,75.88 49,76.09 LED3.C
N$8
  Bottom 1.016: F3.2 15,5.41 15.11,5.3 BAT0.2
N$9
  Top 1.016: R9.2 60.71,75.6 60.71,75.92 60.55,76.09 LED4.C
N$10
  Bottom 1.016: F4.2 27,5.41 26.76,5.17 BAT1.2
N$11
  Bottom 0.508: U$8.6 31.83,11.96 C4.2
N$12
  Bottom 1.016: F5.2 38.5,5.41 38.4,5.31 BAT2.2
N$13
  Bottom 1.016: F6.2 50.1,5.41 50.06,5.37 BAT3.2
N$14
  Bottom 0.508: U$11.6 20.37,12.01 20.36,12.01 C11.2
N$15
  Top 1.016: LED5.C 79.12,76.04 79.29,76.04 R1.2
N$17
  Top 1.016: LED6.C 90.75,76.04 90.81,76.04 R2.2
N$18
  Top 0.152: 79.15,36.68 78.85,36.38 R40.1 | U$17.P$16 79.56,37.09 79.15,36.68 | 79.15,36.68 78.14,37.68 R5.2
N$19
  Top 0.305: PWRLED.A R12.1
N$21
  Bottom 0.508: U$4.6 43.34,12 43.34,11.99 C7.2
N$24  (via drill 0.3 pad 0.6)
  Top 0.152: R3.2 87.32,26.48 87.32,26.25 v87.61,25.96 | U$17.P$3 87.32,33.84 v87.78,33.38
  Route2 0.305: v87.61,25.96 89.01,27.36 89.01,32.15 v87.78,33.38
N$27
  Bottom 0.508: U$13.6 8.2,12.01 8.16,11.96 C18.2
N$29
  Top 0.152: U$17.P$31 84.97,31.46 85.17,31.26 85.17,28.93 C8.1
N$30
  Top 0.152: U$17.P$26 82.47,31.46 82.57,31.37 82.57,29.26 82.25,28.94 C21.1
OUT1_EN  (via drill 0.6 pad 0.9)
  Route2 0.305: v67.54,42.6 67.54,42.56 67.37,42.38
  Route2 0.508: X2.18 32.06,47.18 62.57,47.18 67.37,42.38
  Bottom 0.45: 67.54,44.26 U$24.1
  Bottom 0.508: v67.54,42.6 67.54,44.26
OUT1_G
  Bottom 0.45: U$24.6 66.17,49.68 65.87,49.68 65.82,49.73
  Bottom 0.508: 65.82,49.73 65.12,50.43 U$1.P$4 63.41,51.49 63.83,51.92 63.96,51.92 C24.2
OUT1_S
  Bottom 0.45: 66.83,50.6 U$24.7
  pour Bottom: 27,67 38.75,52.75 50.5,52.75 57.25,49.25 68,49.25 68.5,67
OUT2_EN  (via drill 0.6 pad 0.9)
  Route2 0.508: X2.20 33.9,46.48 61.02,46.48 66,41.5 77.52,41.5 77.79,41.5 v79.99,43.7
  Bottom 0.45: 79.1,43.7 U$25.1
  Bottom 0.508: v79.99,43.7 79.1,43.7
OUT2_G
  Bottom 0.45: 77.17,50.01 U$25.6
  Bottom 0.508: U$14.P$4 74.16,51.49 74.66,51.49 74.87,51.69 | C22.2 74.87,51.69 | 77.17,50.01 75.49,51.69 74.87,51.69
OUT2_S
  Bottom 0.406: 77.83,49.44 77.83,54 77,54 73,54 73,50.42 U$14.P$3
  Bottom 0.45: 77.83,49.44 U$25.7
  pour Bottom: 85,67 78.5,49 69,49 69.5,67
OUT3_EN  (via drill 0.6 pad 0.9)
  Route2 0.508: X2.22 35.7,45.74 56.78,45.74 61.72,40.81 86.04,40.81 88.21,40.81 v90.14,42.74
  Bottom 0.45: 90.14,44.16 U$26.1
  Bottom 0.508: v90.14,42.74 90.14,44.16
OUT3_G
  Bottom 0.45: U$26.6 88.67,49.46 88.62,49.52
  Bottom 0.508: 88.62,49.52 88.62,50.05 86.26,52.42 | 86.26,52.42 86.26,51.52 86.22,51.49 85.91,51.49 U$15.P$4 | C23.2 86.26,52.42
OUT3_S
  Bottom 0.406: U$15.P$3 84.64,53 85,53 85,54 88,54 88,52.45 C23.1
  Bottom 0.45: 89.33,51.5 U$26.7
  pour Bottom: 79.5,49 86.5,67 100,67 100,57 87,49
OUT4_EN  (via drill 0.3 pad 0.6)
  Top 0.152: v87.31,34.51 87.14,34.34 U$17.P$4
  Route2 0.305: v86.26,32.03 86.26,33.46 v87.31,34.51
  Route15 0.152: 38.27,43.26 39.69,43.26 40.66,42.3 40.66,41.99 41.83,40.83
  Route15 0.305: X2.24 38.27,43.26 | v86.26,32.03 85.91,32.03 arc90 85.88,32 78,32 77,33 54,33 49.66,33 41.83,40.83
OUT5_EN  (via drill 0.3 pad 0.6)
  Top 0.152: U$17.P$21 80.59,34.34 79.76,34.34 v79.55,34.55
  Route2 0.152: 79.47,34.55 v79.55,34.55
  Route2 0.305: 79.47,34.55 78.73,33.81 75.78,33.81 70.36,39.23 57.44,39.23 v52.51,44.17
  Route15 0.152: 40.58,43.49 42.5,43.49 43.27,44.26 43.27,44.6 44.19,45.52 51.15,45.52
  Route15 0.305: X2.26 40.58,43.49 | 51.15,45.52 v52.51,44.17
PGOOD1  (via drill 0.3 pad 0.6)
  Top 0.152: U$17.P$5 86.85,34.84 86.85,34.94 v87.21,35.3 | R10.2 67.9,38.29 67.19,38.29 v67.01,38.48
  Route15 0.152: 48.16,42.96 62.52,42.96 v67.01,38.48
  Route15 0.305: v67.01,38.48 79.6,38.48 81.04,37.04 85.46,37.04 v87.21,35.3
  Route15 0.406: X2.31 48.16,42.96
PGOOD2  (via drill 0.3 pad 0.6)
  Top 0.152: v80.18,35.19 80.52,34.84 U$17.P$20 | R14.2 66.47,37.56 66.47,37.39 v66.79,37.06
  Route15 0.152: 78.3,37.06 v80.18,35.19
  Route15 0.305: 78.3,37.06 v66.79,37.06 54.63,37.06 X2.33
PWM_A
  Route2 0.508: X3.3 73.5,7.6 51.07,30.02 51.07,43.16 X2.34
PWM_B
  Route2 0.508: X4.3 66,11.62 48.45,29.18 48.45,43.25 X2.32
PWR1
  Top 0.305: LED1.A 26.9,78.11 28.06,79.27 M1.1
  pour Bottom: 25.25,85.2 35.25,85.2 35.19,69.03 25.19,69.03
  pour Route15: 24,86 30,86 28.5,68 24,68
PWR2
  Top 0.305: LED2.A 38.83,78.34 39.76,79.27 M2.1
  pour Bottom: 37.25,85.2 46.25,85.2 46.25,69 37.25,69
  pour Route15: 42,86 36,86 36,68 40.5,68
PWR3  (via drill 0.6 pad 0.9)
  Top 1.016: v51.22,76.85 50.82,76.85 LED3.A
  pour Bottom: 58.25,69 48.25,69 48.25,85.2 58.25,85.2
  pour Route15: 54,86 48,86 48,68 52.5,68
PWR4  (via drill 0.6 pad 0.9)
  Top 1.016: v61.3,78.87 61.91,78.26 62.05,78.26 LED4.A 62.3,76.93 62.59,76.93
  pour Bottom: 60.25,69 69.25,69 69.35,85.2 60.21,85.2
  pour Route15: 60,86 66,86 62.5,68 60,68
PWR5  (via drill 0.6 pad 0.9)
  Top 1.016: v80.2,78.75 80.62,78.32 LED5.A
  pour Bottom: 76,85.2 76,69 85,69 85,85.2
PWR6  (via drill 0.6 pad 0.9)
  Top 1.016: LED6.A 92.25,78.21 92.14,78.21 v91.47,78.87
  pour Bottom: 88.5,85.2 88.5,69 102,69 102,85.2
SERVO  (via drill 0.6, 0.6 pad 0.9)
  Top 1.016: 74.89,25.9 76.44,27.45 C104.1 | v74.89,25.33 74.89,25.9 | 74.89,25.9 74.78,25.9 74.58,26.09 C2.+ | C104.1 | C104.1 76.76,28.21 SJ100.2
  Top 2.54: 72.02,11.98 L2.2 72.02,12.02 72.02,13.98 arc90 v72,14 | v69,14 v72,14 | v72,14 75,14
  Route15 2.54: 80.79,19.87 78.33,25.33 v74.89,25.33
  Bottom 1.016: v69,14 C30.+
  Bottom 2.54: C30.+ | C15.+ 69.58,12.07 69.58,4.51 69.57,4.5 X4.2
  other vias: 69.5,10 69.5,4 69.5,5.5 69.5,7 69.5,8.5
  pour Route15: 61,0 87.5,0 87.5,20.25 79,20.25 74.5,14.25 61,14.25
SW1
  Top 0.152: SJ108.1 88.67,28.07 88.69,28.09 R31.2 87.91,28.81 87.79,28.93 86.87,28.93 | 86.87,28.93 86.87,30.06 85.47,31.46 U$17.P$32 | C8.2 86.87,28.93
SW2
  Top 0.152: U$17.P$25 81.97,31.46 82.26,31.17 82.26,30.66 80.55,28.94 C21.2 79.77,28.21 78.84,28.21 | 78.84,28.21 R32.2 | 78.84,28.21 78.84,28.17 SJ110.1
V+  (via drill 0.3, 0.6, 0.6 pad 0.9)
  Top 0.305: R12.2 96.59,7.91 v96.5,8
  Top 1.016: 83.55,19.45 v83.55,20.16 | 83.55,19.45 83.96,19.45 C29.2 | C32.1 83.55,19.45 | C3.+ 83.3,12.62 83.3,13.31 v83.34,13.35
  Bottom 0.305: v96.5,8 96.25,8 96.5,8.25 96.5,9.5
  Bottom 0.45: 90.52,48.13 U$26.8 | 78.81,48.34 U$25.8 | 68.02,48.13 U$24.8
  Bottom 1.016: 91.34,47.31 90.52,48.13 | 78.81,47.47 78.81,48.34 | 68.02,47.39 68.02,48.13 | 68.02,48.13
  other vias: 96.25,43.75 59.25,35.25
  pour Bottom: 11.5,26 56.5,26 79.5,9 102,9 102,47.5 58,48 50.5,52 21,52 21,35.25 11.5,32.25
VBAT0
  pour Bottom: 12,12.25 18,12.25 18,8.35 12,8.35
VBAT0_X  (via drill 0.6 pad 0.9)
  Top 0.45: 10.71,21.36 U$20.8
  Top 1.016: v9.22,21.83 9.69,21.36 10.71,21.36 | v10.42,28.3 10.91,28.3 11.71,27.5 R11.2
  Top 1.676: PAD8.1 9.07,37.8 9,37.87 | X2.1 X2.2
  Top 2.184: 9,37.87 9,44.5 | 9.07,37.8 X2.1
  Route2 1.016: v9.22,21.83 11.12,23.73 11.12,27.61 v10.42,28.3 10.42,36.45 9.07,37.8 PAD8.1
  Route15 2.184: v9.22,21.83 17.05,14 PAD1.1
  pour Bottom: 12,19.5 18,19.5 18,13 12,13
VBAT1
  pour Bottom: 24,12.25 30,12.25 30,8.35 24,8.35
VBAT1_X  (via drill 0.6 pad 0.9)
  Top 0.45: 23.88,20.52 23.88,21.52 U$22.8
  Top 1.016: PAD2.1 29.5,15.49 28.91,15.49 26.99,17.41 23.88,20.52 | v22.99,28.3 v23,28.3 23.67,27.63 R15.2
  Top 1.676: X2.3 11.64,41.95
  Top 2.184: 11.64,41.95 PAD7.1 | X2.4 X2.3
  Route2 1.016: PAD2.1 29.17,14.33 29.17,23.14 v31.14,25.12
  Route15 1.016: 30,25 29.88,25.12 v31.14,25.12
  Route15 2.184: 30,25 29.88,25.12 26.7,28.3 v22.99,28.3 21.12,28.3 18.7,28.3 12,35 11.64,35.36 PAD7.1
  pour Bottom: 24,19.5 30,19.5 30,13 24,13
VBAT2
  pour Bottom: 35.5,12.25 41.5,12.25 41.5,8.35 35.5,8.35
VBAT2_X  (via drill 0.6 pad 0.9)
  Top 0.45: 34.58,19.39 33.57,20.39 33.57,21.52 U$21.8
  Top 1.016: R17.2 35.4,27.62 34.75,28.26 v34.21,28.26 | v34.52,19.33 34.58,19.39
  Top 1.676: X2.5
  Top 2.184: PAD6.1 X2.5 | X2.5 X2.6
  Route2 1.016: X2.5 | v34.52,19.33 34.52,22.92 35.2,23.6 35.2,27.27 v34.21,28.26
  Route15 1.016: PAD6.1 16.51,35.41 27.06,35.41
  Route15 2.184: 27.06,35.41 v34.21,28.26
  Bottom 1.016: 36.69,14.72 34.52,16.89 v34.52,19.33
  pour Bottom: 35.5,19.5 41.5,19.5 41.5,12.95 35.5,12.95
VBAT3
  pour Bottom: 47,12.25 53,12.25 53,8.35 47,8.35
VBAT3_X  (via drill 0.6 pad 0.9)
  Top 0.45: U$23.8
  Top 0.508: U$23.8 45.67,19.67 v46.01,19.33 | v46.01,27.16 46.63,27.16 46.97,27.5 R19.2
  Top 1.676: PAD5.1
  Top 2.184: PAD5.1 X2.7 X2.8
  Route2 1.016: v46.01,19.33 45.86,19.48 45.86,24 46.61,24.75 46.61,26.56 v46.01,27.16 | PAD5.1
  Route15 1.016: PAD5.1 17.36,38.11 | 27.75,38.11 27.43,38.11 30.45,38.11
  Route15 1.422: 41.37,27.16 v46.01,27.16
  Route15 1.778: 17.36,38.11 27.75,38.11 | 30.45,38.11 41.37,27.16
  Bottom 1.016: 48.19,14.38 46.01,16.57 v46.01,19.33
  pour Bottom: 47,19.5 53,19.5 53,12.95 47,12.95
VIN  (via drill 0.3 pad 0.6)
  Top 0.152: U$17.P$23 80.59,33.34 80.59,33.08 80.35,32.83 79.53,32.83 v79.27,33.09
  Bottom 0.152: SJ104.1 78.86,32.97 78.97,33.09 v79.27,33.09
VREF2
  Top 0.152: U$17.P$6 85.59,35.34 85.59,35.54 84.67,36.46 83.47,36.46 | 83.47,36.46 83.47,36.54 U$17.P$13 83.36,37.2 83.36,39.34 | U$17.P$19 81.85,35.34 81.85,35.55 82.75,36.46 83.47,36.46 | 83.36,39.34 | R39.1 83.36,39.34 | 83.36,39.34 83.69,39.34 R23.2 | C34.2 84.16,41.53 83.7,41.53 83.68,41.51 | 83.68,41.51 83.37,41.51 C33.2 83.05,40.68 83.36,40.37 83.36,39.34 | C10.1 83.68,41.51
VREG3
  Top 0.152: U$17.P$22 80.59,33.84 80.54,33.9 79.08,33.9 78.52,33.33 75.55,33.33 74.29,34.59 C17.2 68.59,34.59 67.9,35.28 | R14.1 66.47,35.86 67.05,35.28 67.9,35.28 | R10.1 67.9,35.28
X1  (via drill 0.6 pad 0.9)
  Top 1.016: SJ108.2 88.67,24.58 89.07,24.58 | 91.44,22.32 91.89,21.87
  Top 1.422: 89.07,24.58 v91.33,22.32
  Top 2.54: L1.2 91.89,21.87 | v91.33,22.32 91.44,22.32
  Bottom 0.305: U$106.5 88.55,25 88.67,25 88.67,23.3 87,23.3
  Bottom 1.93: 85.6,23.3 87,23.3 90.35,23.3 v91.33,22.32
  pour Bottom: 84.65,24.12 84.65,21.12 88.65,21.12 88.65,24.12
X2  (via drill 0.6 pad 0.9)
  Top 0.508: 78.84,24.44 77,22
  Top 1.016: v76.72,22.32 78.84,24.44 SJ110.2 | 75.42,21.93 75.57,21.96
  Top 1.93: 75.57,21.96 v76.72,22.32 | L2.1 75,21.93 75.42,21.93
  Top 2.54: 75,21.99 75,21.93
  Bottom 0.508: U$108.1 77.83,21.22 v76.72,22.32
  Bottom 1.016: 77.02,22.62 v76.72,22.32
  Bottom 2.54: 80.21,22.62 77.02,22.62
  pour Bottom: 78.65,24.12 78.65,21.12 82.65,21.12 82.65,24.12